# Altium project GargantuRAM_1_5_PRE_GITHUB.PrjPcb (part 2 of 3)

## Sheet SD_RTC_SPI.SchDoc
size A0; SheetNumber: 6; SheetTotal: 12
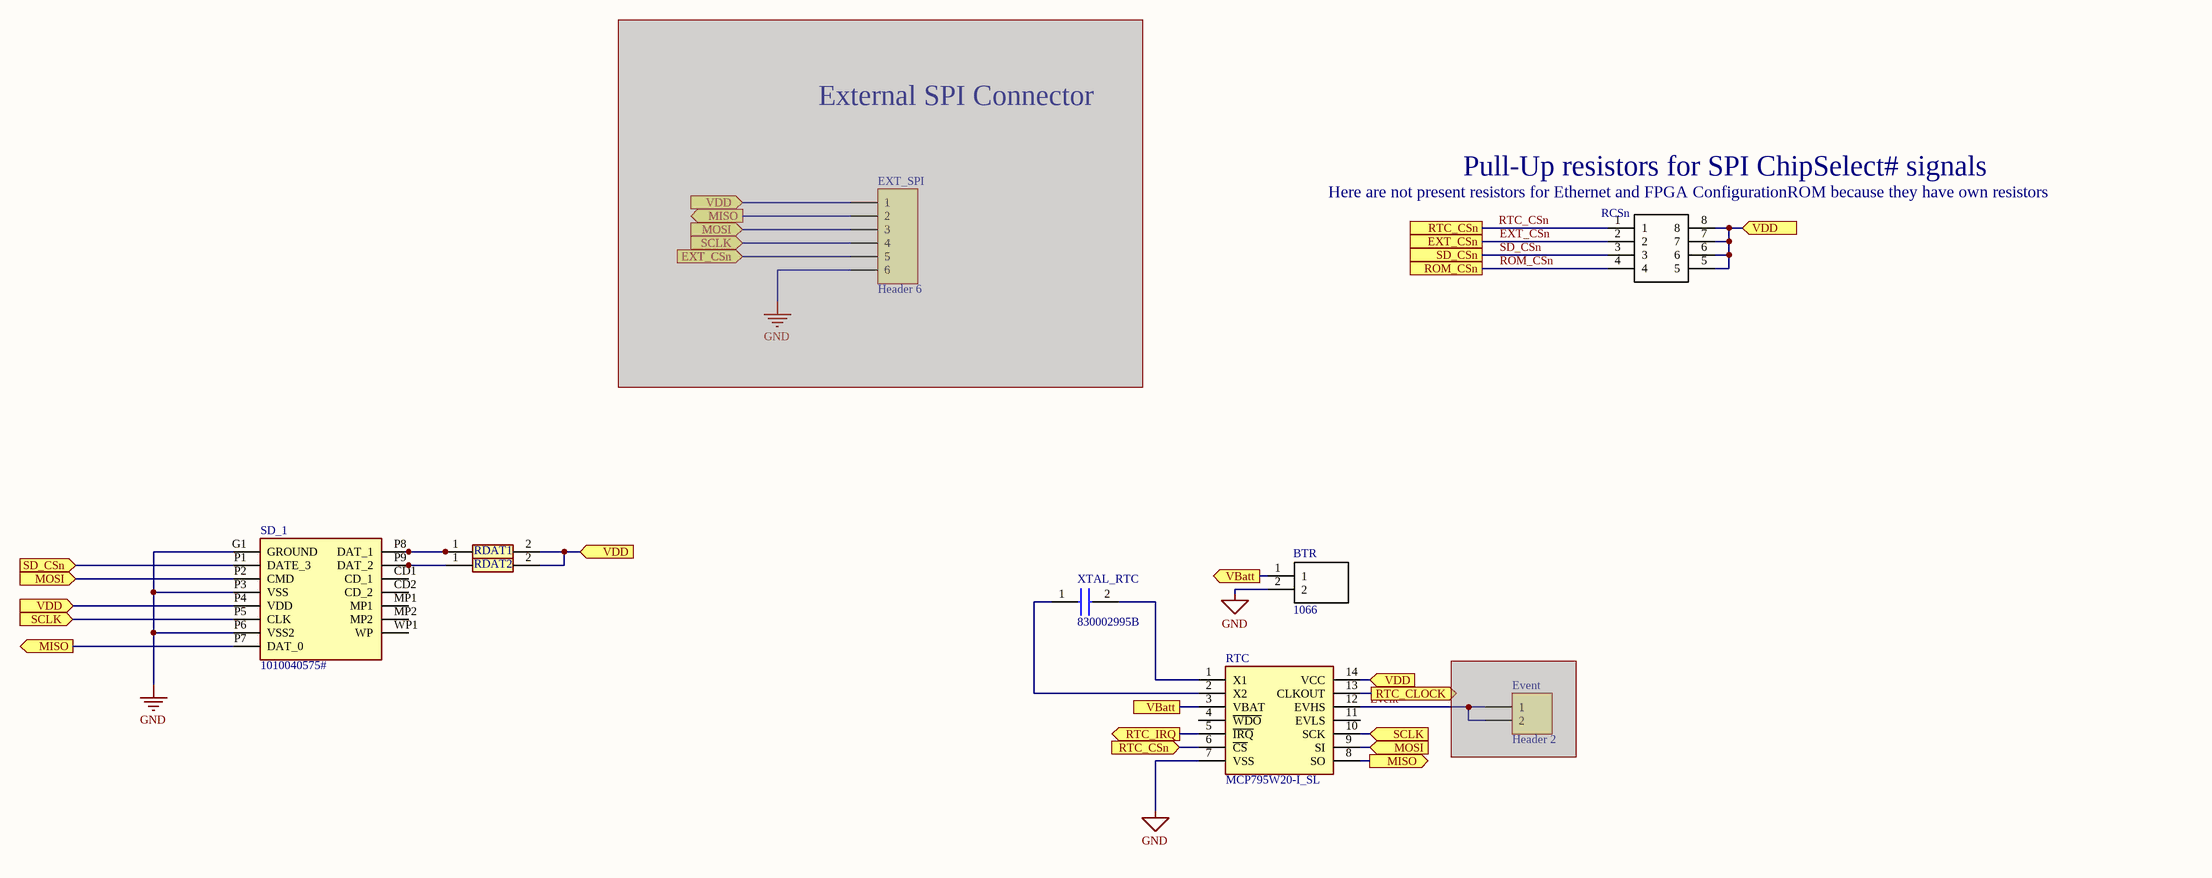
[diagram p7: SD_RTC_SPI.SchDoc]

### Parts
BTR  1066  [1066]
Event  Header 2  [HDR1X2]  (masked out: inside a compile mask, not in the netlist)
EXT_SPI  Header 6  [HDR1X6]  (masked out: inside a compile mask, not in the netlist)
RCSn  CAT16A-1002F4LF  [CAT16A1002F4LF]  (value not drawn)
RDAT1  CRCW060310K0FKEC  [RESC1608X50N]  (value not drawn)
RDAT2  CRCW060310K0FKEC  [RESC1608X50N]  (value not drawn)
RTC  MCP795W20-I_SL  [SOIC127P600X175-14N]
SD_1  1010040575#  [1010040575]
XTAL_RTC  830002995B  [830002995B]

### Ports
EXT_CSn, EXT_CSn (in), MISO (out), MOSI (in), ROM_CSn, RTC_CLOCK (out), RTC_CSn, RTC_CSn (in), RTC_IRQ (out), SCLK (in), SD_CSn, SD_CSn (in), VBatt, VBatt (out), VDD (in)

### Nets
GND: BTR.2 RTC.7(VSS) SD_1.G1(GROUND) SD_1.P3(VSS) SD_1.P6(VSS2)
Event: RTC.12(EVHS)
EXT_CSn: RCSn.2 ; port EXT_CSn
MISO: RTC.8(SO) SD_1.P7(DAT_0) ; port MISO
MOSI: RTC.9(SI) SD_1.P2(CMD) ; port MOSI
ROM_CSn: RCSn.4 ; port ROM_CSn
RTC_CLOCK: RTC.13(CLKOUT) ; port RTC_CLOCK
RTC_CSn: RCSn.1 RTC.6(~{CS}) ; port RTC_CSn
RTC_IRQ: RTC.5(~{IRQ}) ; port RTC_IRQ
SCLK: RTC.10(SCK) SD_1.P5(CLK) ; port SCLK
SD_CSn: RCSn.3 SD_1.P1(DATE_3) ; port SD_CSn
VDD: RCSn.5 RCSn.6 RCSn.7 RCSn.8 RDAT1.2 RDAT2.2 RTC.14(VCC) SD_1.P4(VDD) ; port VDD
NetBTR_1: BTR.1 RTC.3(VBAT) ; port VBatt
NetRDAT1_1: RDAT1.1 SD_1.P8(DAT_1)
NetRDAT2_1: RDAT2.1 SD_1.P9(DAT_2)
NetRTC_1: RTC.1(X1) XTAL_RTC.2(CRYSTAL_2)
NetRTC_2: RTC.2(X2) XTAL_RTC.1(CRYSTAL_1)

Not connected (* = marked no-connect by the designer): RTC 4(~{WDO}) 11(EVLS); SD_1 CD1(CD_1) CD2(CD_2) MP1 MP2 WP1(WP)

### Notes on the sheet
- External SPI Connector
- (near RCSn) Pull-Up resistors for SPI ChipSelect# signals
- (near RCSn) Here are not present resistors for Ethernet and FPGA ConfigurationROM because they have own resistors

### Library data of the parts
BTR = 1066: Undefined or Miscellaneous; Manufacturer_Name: Keystone Electronics; Datasheet Link: http://keyelco.com/userAssets/file/M65p5.pdf; Height: 9.85mm; Manufacturer_Part_Number: 1066; Mouser Part Number: 534-1066; Mouser Price/Stock: https://www.mouser.co.uk/ProductDetail/Keystone-Electronics/1066?qs=TMDrOSIpnUfyx7dWA5t7YA%3D%3D
Event = Header 2: Header, 2-Pin; LatestRevisionDate: 17-Jul-2002; LatestRevisionNote: Re-released for DXP Platform.; Publisher: Altium Limited
EXT_SPI = Header 6: Header, 6-Pin; LatestRevisionDate: 17-Jul-2002; LatestRevisionNote: Re-released for DXP Platform.; Publisher: Altium Limited
RCSn = CAT16A-1002F4LF: Resistor Network; Manufacturer_Name: Bourns; Datasheet Link: https://www.bourns.com/docs/product-datasheets/cat16a-lf.pdf?sfvrsn=f78c48f6_4; Height: 0.65mm; Manufacturer_Part_Number: CAT16A-1002F4LF; Mouser Part Number: 652-CAT16A-1002F4LF; Mouser Price/Stock: https://www.mouser.co.uk/ProductDetail/Bourns/CAT16A-1002F4LF?qs=IS%252B4QmGtzzqwI8c1abvAYA%3D%3D
RDAT1 RDAT2 = CRCW060310K0FKEC: Resistor; Manufacturer_Name: Vishay; Datasheet Link: http://www.vishay.com/docs/20035/dcrcwe3.pdf; Height: 0.5mm; Manufacturer_Part_Number: CRCW060310K0FKEC; Mouser Part Number: 71-CRCW060310K0FKEC; Mouser Price/Stock: https://www.mouser.co.uk/ProductDetail/Vishay-Dale/CRCW060310K0FKEC?qs=DhCTQV%252BB7kVUX5brQUG3LA%3D%3D; Arrow Part Number: CRCW060310K0FKEC; Arrow Price/Stock: https://www.arrow.com/en/products/crcw060310k0fkec/vishay?region=nac
RTC = MCP795W20-I_SL: Integrated Circuit; Manufacturer_Name: Microchip; Manufacturer_Part_Number: MCP795W20-I/SL; Datasheet Link: http://www.microchip.com/mymicrochip/filehandler.aspx?ddocname=en556469; Height: 1.75mm; Mouser Part Number: 579-MCP795W20-I/SL; Mouser Price/Stock: https://www.mouser.co.uk/ProductDetail/Microchip-Technology/MCP795W20-I-SL?qs=tc5aKIj3JEqUBv0X09nRdg%3D%3D; Arrow Part Number: MCP795W20-I/SL; Arrow Price/Stock: https://www.arrow.com/en/products/mcp795w20-isl/microchip-technology
SD_1 = 1010040575#: Connector; Manufacturer_Name: Amphenol Communications Solutions; Datasheet Link: https://cdn.amphenol-cs.com/media/wysiwyg/files/drawing/1010040575.pdf; Height: 4.8mm; Manufacturer_Part_Number: 1010040575#; Mouser Part Number: 523-1010040575#; Mouser Price/Stock: https://www.mouser.co.uk/ProductDetail/Amphenol-Commercial-Products/1010040575?qs=ToP8pWlZ0bNfojQLHmjlUA%3D%3D; Arrow Part Number: 1010040575#; Arrow Price/Stock: https://www.arrow.com/en/products/1010040575/amphenol
XTAL_RTC = 830002995B: Capacitor; Manufacturer_Name: Wurth Elektronik; Datasheet Link: https://www.mouser.de/datasheet/2/445/830002995B-2005217.pdf; Height: 8.2mm; Manufacturer_Part_Number: 830002995B; Mouser Part Number: 710-830002995B; Mouser Price/Stock: https://www.mouser.co.uk/ProductDetail/Wurth-Elektronik/830002995B?qs=2WXlatMagcHCnw26vHVZcg%3D%3D

## Sheet RAM.SchDoc
size A0; SheetNumber: 7; SheetTotal: 12
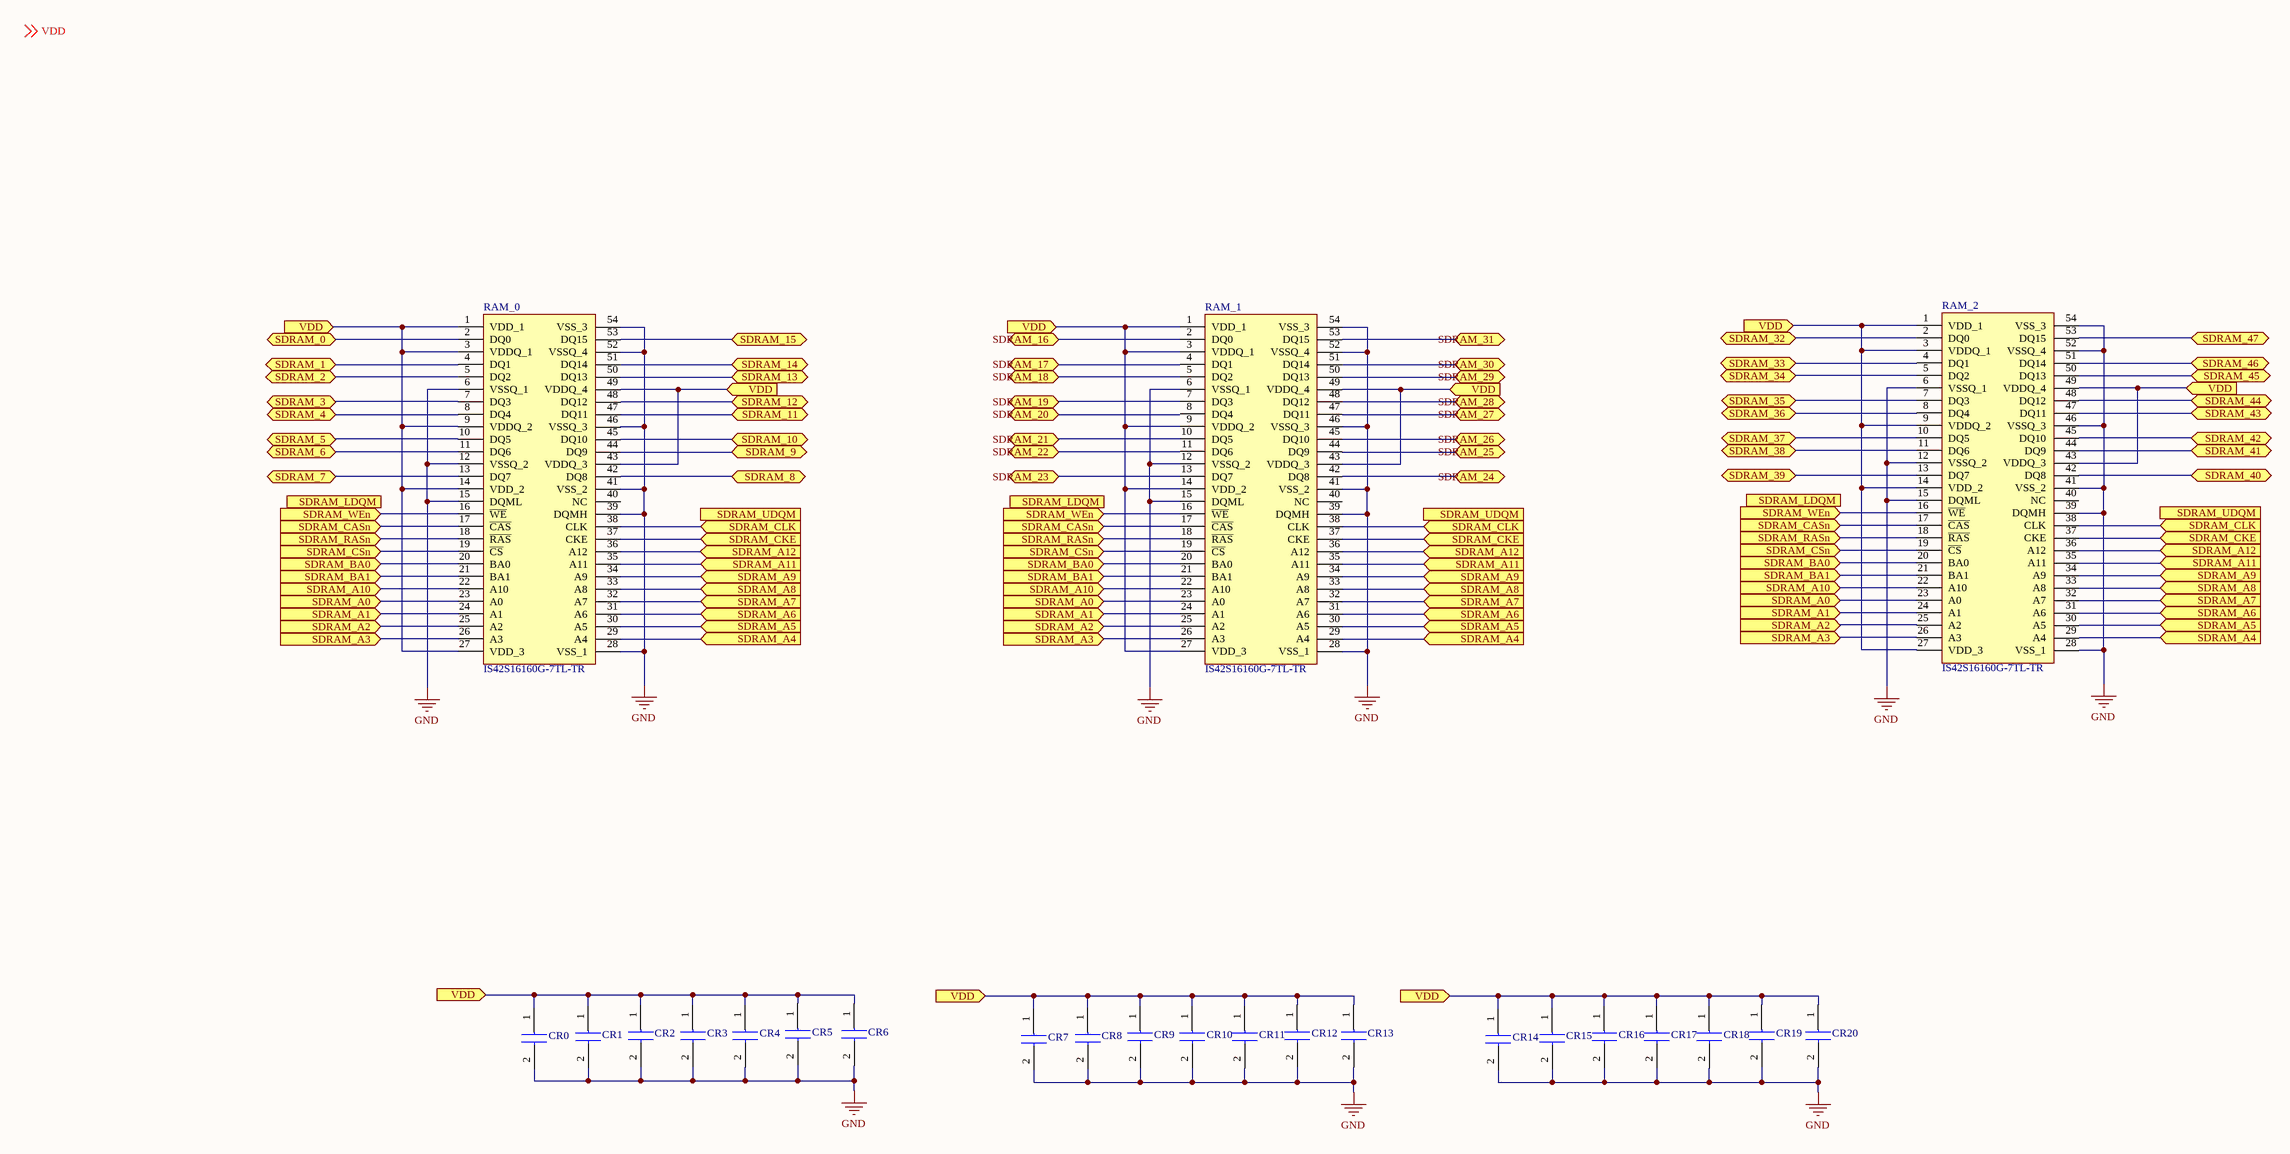
[diagram p8: RAM.SchDoc]

### Parts
CR0  GRM155R71C104JA88D  [CAPC1005X55N]  (value not drawn)
CR1  GRM155R71C104JA88D  [CAPC1005X55N]  (value not drawn)
CR2  GRM155R71C104JA88D  [CAPC1005X55N]  (value not drawn)
CR3  GRM155R71C104JA88D  [CAPC1005X55N]  (value not drawn)
CR4  GRM155R71C104JA88D  [CAPC1005X55N]  (value not drawn)
CR5  GRM155R71C104JA88D  [CAPC1005X55N]  (value not drawn)
CR6  GRM155R71C104JA88D  [CAPC1005X55N]  (value not drawn)
CR7  GRM155R71C104JA88D  [CAPC1005X55N]  (value not drawn)
CR8  GRM155R71C104JA88D  [CAPC1005X55N]  (value not drawn)
CR9  GRM155R71C104JA88D  [CAPC1005X55N]  (value not drawn)
CR10  GRM155R71C104JA88D  [CAPC1005X55N]  (value not drawn)
CR11  GRM155R71C104JA88D  [CAPC1005X55N]  (value not drawn)
CR12  GRM155R71C104JA88D  [CAPC1005X55N]  (value not drawn)
CR13  GRM155R71C104JA88D  [CAPC1005X55N]  (value not drawn)
CR14  GRM155R71C104JA88D  [CAPC1005X55N]  (value not drawn)
CR15  GRM155R71C104JA88D  [CAPC1005X55N]  (value not drawn)
CR16  GRM155R71C104JA88D  [CAPC1005X55N]  (value not drawn)
CR17  GRM155R71C104JA88D  [CAPC1005X55N]  (value not drawn)
CR18  GRM155R71C104JA88D  [CAPC1005X55N]  (value not drawn)
CR19  GRM155R71C104JA88D  [CAPC1005X55N]  (value not drawn)
CR20  GRM155R71C104JA88D  [CAPC1005X55N]  (value not drawn)
RAM_0  IS42S16160G-7TL-TR  [SOP80P1176X120-54N]
RAM_1  IS42S16160G-7TL-TR  [SOP80P1176X120-54N]
RAM_2  IS42S16160G-7TL-TR  [SOP80P1176X120-54N]

### Ports
SDRAM_0 (bidir), SDRAM_1 (bidir), SDRAM_2 (bidir), SDRAM_3 (bidir), SDRAM_4 (bidir), SDRAM_5 (bidir), SDRAM_6 (bidir), SDRAM_7 (bidir), SDRAM_8 (bidir), SDRAM_9 (bidir), SDRAM_10 (bidir), SDRAM_11 (bidir), SDRAM_12 (bidir), SDRAM_13 (bidir), SDRAM_14 (bidir), SDRAM_15 (bidir), SDRAM_16 (bidir), SDRAM_17 (bidir), SDRAM_18 (bidir), SDRAM_19 (bidir), SDRAM_20 (bidir), SDRAM_21 (bidir), SDRAM_22 (bidir), SDRAM_23 (bidir), SDRAM_24 (bidir), SDRAM_25 (bidir), SDRAM_26 (bidir), SDRAM_27 (bidir), SDRAM_28 (bidir), SDRAM_29 (bidir), SDRAM_30 (bidir), SDRAM_31 (bidir), SDRAM_32 (bidir), SDRAM_33 (bidir), SDRAM_34 (bidir), SDRAM_35 (bidir), SDRAM_36 (bidir), SDRAM_37 (bidir), SDRAM_38 (bidir), SDRAM_39 (bidir), SDRAM_40 (bidir), SDRAM_41 (bidir), SDRAM_42 (bidir), SDRAM_43 (bidir), SDRAM_44 (bidir), SDRAM_45 (bidir), SDRAM_46 (bidir), SDRAM_47 (bidir), SDRAM_A0 (in), SDRAM_A1 (in), SDRAM_A2 (in), SDRAM_A3 (in), SDRAM_A4 (in), SDRAM_A5 (in), SDRAM_A6 (in), SDRAM_A7 (in), SDRAM_A8 (in), SDRAM_A9 (in), SDRAM_A10 (in), SDRAM_A11 (in), SDRAM_A12 (in), SDRAM_BA0 (in), SDRAM_BA1 (in), SDRAM_CASn (in), SDRAM_CKE (in), SDRAM_CLK (in), SDRAM_CSn (in), SDRAM_LDQM (in), SDRAM_RASn (in), SDRAM_UDQM (in), SDRAM_WEn (in), VDD (in)

### Nets
GND: CR0.2 CR1.2 CR2.2 CR3.2 CR4.2 CR5.2 CR6.2 CR7.2 CR8.2 CR9.2 CR10.2 CR11.2 CR12.2 CR13.2 CR14.2 CR15.2 CR16.2 CR17.2 CR18.2 CR19.2 CR20.2 RAM_0.6(VSSQ_1) RAM_0.12(VSSQ_2) RAM_0.15(DQML) RAM_0.28(VSS_1) RAM_0.39(DQMH) RAM_0.41(VSS_2) RAM_0.46(VSSQ_3) RAM_0.52(VSSQ_4) RAM_0.54(VSS_3) RAM_1.6(VSSQ_1) RAM_1.12(VSSQ_2) RAM_1.15(DQML) RAM_1.28(VSS_1) RAM_1.39(DQMH) RAM_1.41(VSS_2) RAM_1.46(VSSQ_3) RAM_1.52(VSSQ_4) RAM_1.54(VSS_3) RAM_2.6(VSSQ_1) RAM_2.12(VSSQ_2) RAM_2.15(DQML) RAM_2.28(VSS_1) RAM_2.39(DQMH) RAM_2.41(VSS_2) RAM_2.46(VSSQ_3) RAM_2.52(VSSQ_4) RAM_2.54(VSS_3)
BA0: RAM_0.20(BA0) RAM_1.20(BA0) RAM_2.20(BA0) ; port SDRAM_BA0
BA1: RAM_0.21(BA1) RAM_1.21(BA1) RAM_2.21(BA1) ; port SDRAM_BA1
CASn: RAM_0.17(~{CAS}) RAM_1.17(~{CAS}) RAM_2.17(~{CAS}) ; port SDRAM_CASn
CKE: RAM_0.37(CKE) RAM_1.37(CKE) RAM_2.37(CKE) ; port SDRAM_CKE
CSn: RAM_0.19(~{CS}) RAM_1.19(~{CS}) RAM_2.19(~{CS}) ; port SDRAM_CSn
RAM_CLK: RAM_0.38(CLK) RAM_1.38(CLK) RAM_2.38(CLK) ; port SDRAM_CLK
RASn: RAM_0.18(~{RAS}) RAM_1.18(~{RAS}) RAM_2.18(~{RAS}) ; port SDRAM_RASn
SDRAM_A1: RAM_0.24(A1) RAM_1.24(A1) RAM_2.24(A1) ; port SDRAM_A1
SDRAM_A2: RAM_0.25(A2) RAM_1.25(A2) RAM_2.25(A2) ; port SDRAM_A2
VDD: CR0.1 CR1.1 CR2.1 CR3.1 CR4.1 CR5.1 CR6.1 CR7.1 CR8.1 CR9.1 CR10.1 CR11.1 CR12.1 CR13.1 CR14.1 CR15.1 CR16.1 CR17.1 CR18.1 CR19.1 CR20.1 RAM_0.1(VDD_1) RAM_0.3(VDDQ_1) RAM_0.9(VDDQ_2) RAM_0.14(VDD_2) RAM_0.27(VDD_3) RAM_0.43(VDDQ_3) RAM_0.49(VDDQ_4) RAM_1.1(VDD_1) RAM_1.3(VDDQ_1) RAM_1.9(VDDQ_2) RAM_1.14(VDD_2) RAM_1.27(VDD_3) RAM_1.43(VDDQ_3) RAM_1.49(VDDQ_4) RAM_2.1(VDD_1) RAM_2.3(VDDQ_1) RAM_2.9(VDDQ_2) RAM_2.14(VDD_2) RAM_2.27(VDD_3) RAM_2.43(VDDQ_3) RAM_2.49(VDDQ_4) ; port VDD
WEn: RAM_0.16(~{WE}) RAM_1.16(~{WE}) RAM_2.16(~{WE}) ; port SDRAM_WEn
NetLassye3_AA13: RAM_0.23(A0) RAM_1.23(A0) RAM_2.23(A0) ; port SDRAM_A0
NetLassye3_AB2: RAM_0.26(A3) RAM_1.26(A3) RAM_2.26(A3) ; port SDRAM_A3
NetLassye3_AB3: RAM_0.29(A4) RAM_1.29(A4) RAM_2.29(A4) ; port SDRAM_A4
NetLassye3_AB4: RAM_0.30(A5) RAM_1.30(A5) RAM_2.30(A5) ; port SDRAM_A5
NetLassye3_AB5: RAM_0.31(A6) RAM_1.31(A6) RAM_2.31(A6) ; port SDRAM_A6
NetLassye3_AB6: RAM_0.32(A7) RAM_1.32(A7) RAM_2.32(A7) ; port SDRAM_A7
NetLassye3_AB7: RAM_0.33(A8) RAM_1.33(A8) RAM_2.33(A8) ; port SDRAM_A8
NetLassye3_AB8: RAM_0.34(A9) RAM_1.34(A9) RAM_2.34(A9) ; port SDRAM_A9
NetLassye3_AB9: RAM_0.22(A10) RAM_1.22(A10) RAM_2.22(A10) ; port SDRAM_A10
NetLassye3_AB10: RAM_0.35(A11) RAM_1.35(A11) RAM_2.35(A11) ; port SDRAM_A11
NetLassye3_AB11: RAM_0.2(DQ0) ; port SDRAM_0
NetLassye3_AB12: RAM_0.4(DQ1) ; port SDRAM_1
NetLassye3_AB13: RAM_0.5(DQ2) ; port SDRAM_2
NetLassye3_AB14: RAM_0.7(DQ3) ; port SDRAM_3
NetLassye3_AB17: RAM_0.11(DQ6) ; port SDRAM_6
NetLassye3_P1: RAM_1.10(DQ5) ; port SDRAM_21
NetLassye3_P2: RAM_1.11(DQ6) ; port SDRAM_22
NetLassye3_P3: RAM_1.13(DQ7) ; port SDRAM_23
NetLassye3_P4: RAM_1.53(DQ15) ; port SDRAM_31
NetLassye3_R1: RAM_2.47(DQ11) ; port SDRAM_43
NetLassye3_R2: RAM_2.48(DQ12) ; port SDRAM_44
NetLassye3_R3: RAM_2.50(DQ13) ; port SDRAM_45
NetLassye3_R6: RAM_2.51(DQ14) ; port SDRAM_46
NetLassye3_R7: RAM_2.53(DQ15) ; port SDRAM_47
NetLassye3_R10: RAM_0.36(A12) RAM_1.36(A12) RAM_2.36(A12) ; port SDRAM_A12
NetLassye3_T6: RAM_2.42(DQ8) ; port SDRAM_40
NetLassye3_T8: RAM_2.44(DQ9) ; port SDRAM_41
NetLassye3_T10: RAM_2.45(DQ10) ; port SDRAM_42
NetLassye3_T13: RAM_0.8(DQ4) ; port SDRAM_4
NetLassye3_T14: RAM_0.10(DQ5) ; port SDRAM_5
NetLassye3_U7: RAM_2.2(DQ0) ; port SDRAM_32
NetLassye3_U8: RAM_2.4(DQ1) ; port SDRAM_33
NetLassye3_U9: RAM_2.5(DQ2) ; port SDRAM_34
NetLassye3_U10: RAM_2.7(DQ3) ; port SDRAM_35
NetLassye3_U11: RAM_2.8(DQ4) ; port SDRAM_36
NetLassye3_U12: RAM_2.10(DQ5) ; port SDRAM_37
NetLassye3_U13: RAM_2.11(DQ6) ; port SDRAM_38
NetLassye3_U14: RAM_2.13(DQ7) ; port SDRAM_39
NetLassye3_V7: RAM_1.42(DQ8) ; port SDRAM_24
NetLassye3_V8: RAM_1.44(DQ9) ; port SDRAM_25
NetLassye3_V9: RAM_1.45(DQ10) ; port SDRAM_26
NetLassye3_V10: RAM_1.47(DQ11) ; port SDRAM_27
NetLassye3_V11: RAM_1.48(DQ12) ; port SDRAM_28
NetLassye3_V12: RAM_1.50(DQ13) ; port SDRAM_29
NetLassye3_V14: RAM_1.51(DQ14) ; port SDRAM_30
NetLassye3_W2: RAM_0.48(DQ12) ; port SDRAM_12
NetLassye3_W3: RAM_0.50(DQ13) ; port SDRAM_13
NetLassye3_W4: RAM_0.51(DQ14) ; port SDRAM_14
NetLassye3_W8: RAM_0.53(DQ15) ; port SDRAM_15
NetLassye3_W9: RAM_1.2(DQ0) ; port SDRAM_16
NetLassye3_W10: RAM_1.4(DQ1) ; port SDRAM_17
NetLassye3_W11: RAM_1.5(DQ2) ; port SDRAM_18
NetLassye3_W12: RAM_1.7(DQ3) ; port SDRAM_19
NetLassye3_W14: RAM_1.8(DQ4) ; port SDRAM_20
NetLassye3_Y1: RAM_0.13(DQ7) ; port SDRAM_7
NetLassye3_Y6: RAM_0.42(DQ8) ; port SDRAM_8
NetLassye3_Y7: RAM_0.44(DQ9) ; port SDRAM_9
NetLassye3_Y13: RAM_0.45(DQ10) ; port SDRAM_10
NetLassye3_Y14: RAM_0.47(DQ11) ; port SDRAM_11

Not connected (* = marked no-connect by the designer): RAM_0 40(NC); RAM_1 40(NC); RAM_2 40(NC)

### Notes on the sheet
- Labels drawn without touching a wire or pin: VDD

### Library data of the parts
CR0-CR20 = GRM155R71C104JA88D: Capacitor; Manufacturer_Name: Murata Electronics; Datasheet Link: http://www.murata.com/~/media/webrenewal/support/library/catalog/products/capacitor/mlcc/c02e.pdf; Height: 0.55mm; Manufacturer_Part_Number: GRM155R71C104JA88D; Mouser Part Number: 81-GRM155R71C104JA8D; Mouser Price/Stock: https://www.mouser.co.uk/ProductDetail/Murata-Electronics/GRM155R71C104JA88D?qs=pwh76yelNxDjPOceoz6xEg%3D%3D; Arrow Part Number: GRM155R71C104JA88D; Arrow Price/Stock: https://www.arrow.com/en/products/grm155r71c104ja88d/murata-manufacturing?region=nac
RAM_0-RAM_2 = IS42S16160G-7TL-TR: Integrated Circuit; Manufacturer_Name: Integrated Silicon Solution Inc.; Datasheet Link: http://www.issi.com/WW/pdf/42-45S83200G-16160G.pdf; Height: 1.2mm; Manufacturer_Part_Number: IS42S16160G-7TL-TR; Mouser Part Number: 870-IS42S16160G7TLTR; Mouser Price/Stock: https://www.mouser.co.uk/ProductDetail/ISSI/IS42S16160G-7TL-TR?qs=9hm%252BDT1Jr7xnYjoaQib7SQ%3D%3D; Arrow Part Number: IS42S16160G-7TL-TR; Arrow Price/Stock: https://www.arrow.com/en/products/is42s16160g-7tl-tr/integrated-silicon-solution-inc?region=nac

## Sheet FPGA.SchDoc
size A0; SheetNumber: 8; SheetTotal: 12
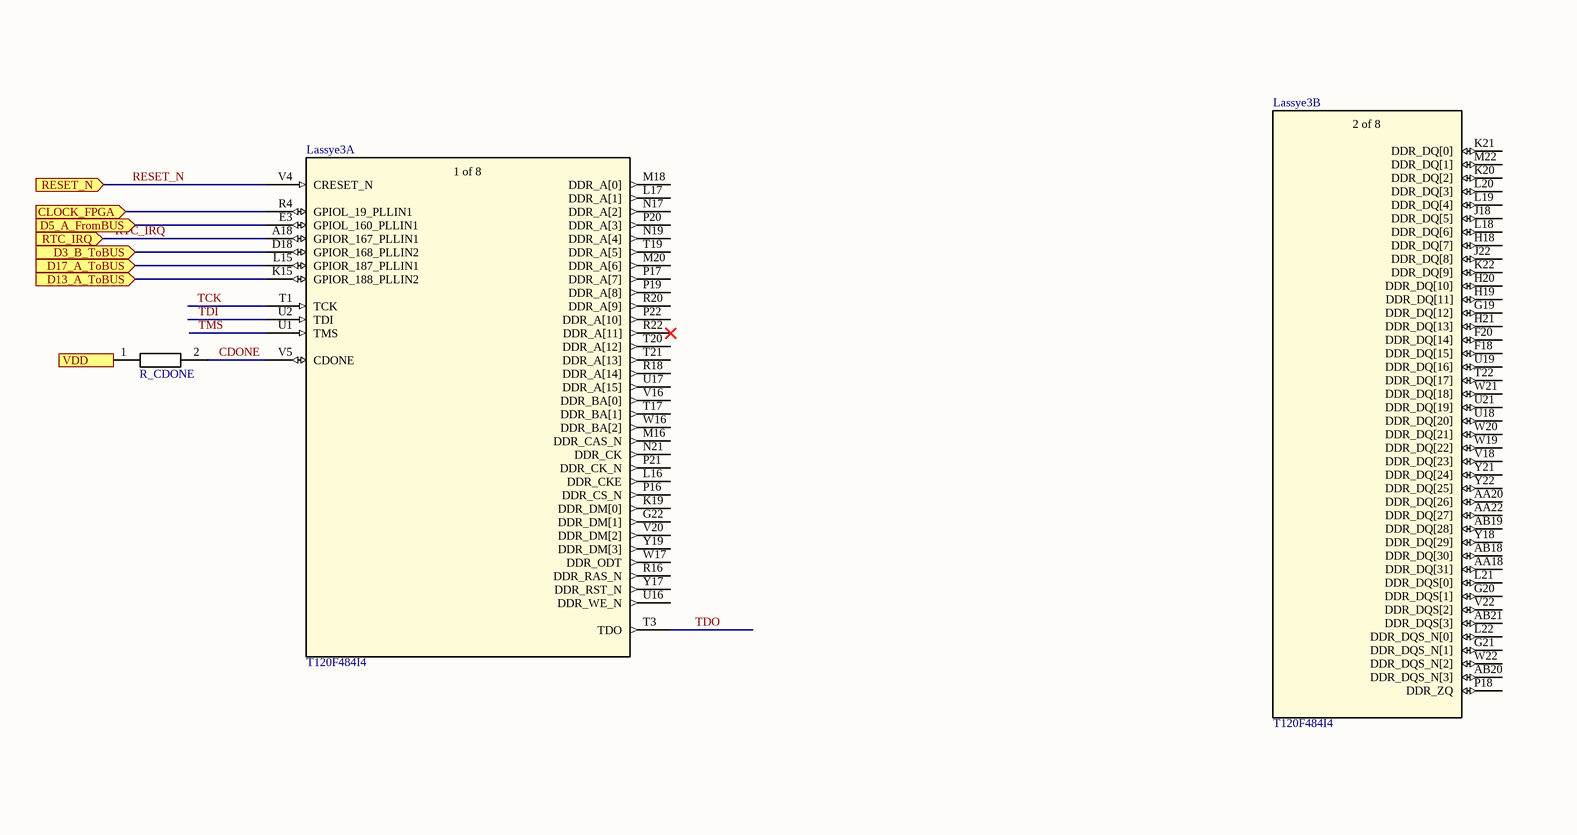
[diagram p9: FPGA.SchDoc, top left]
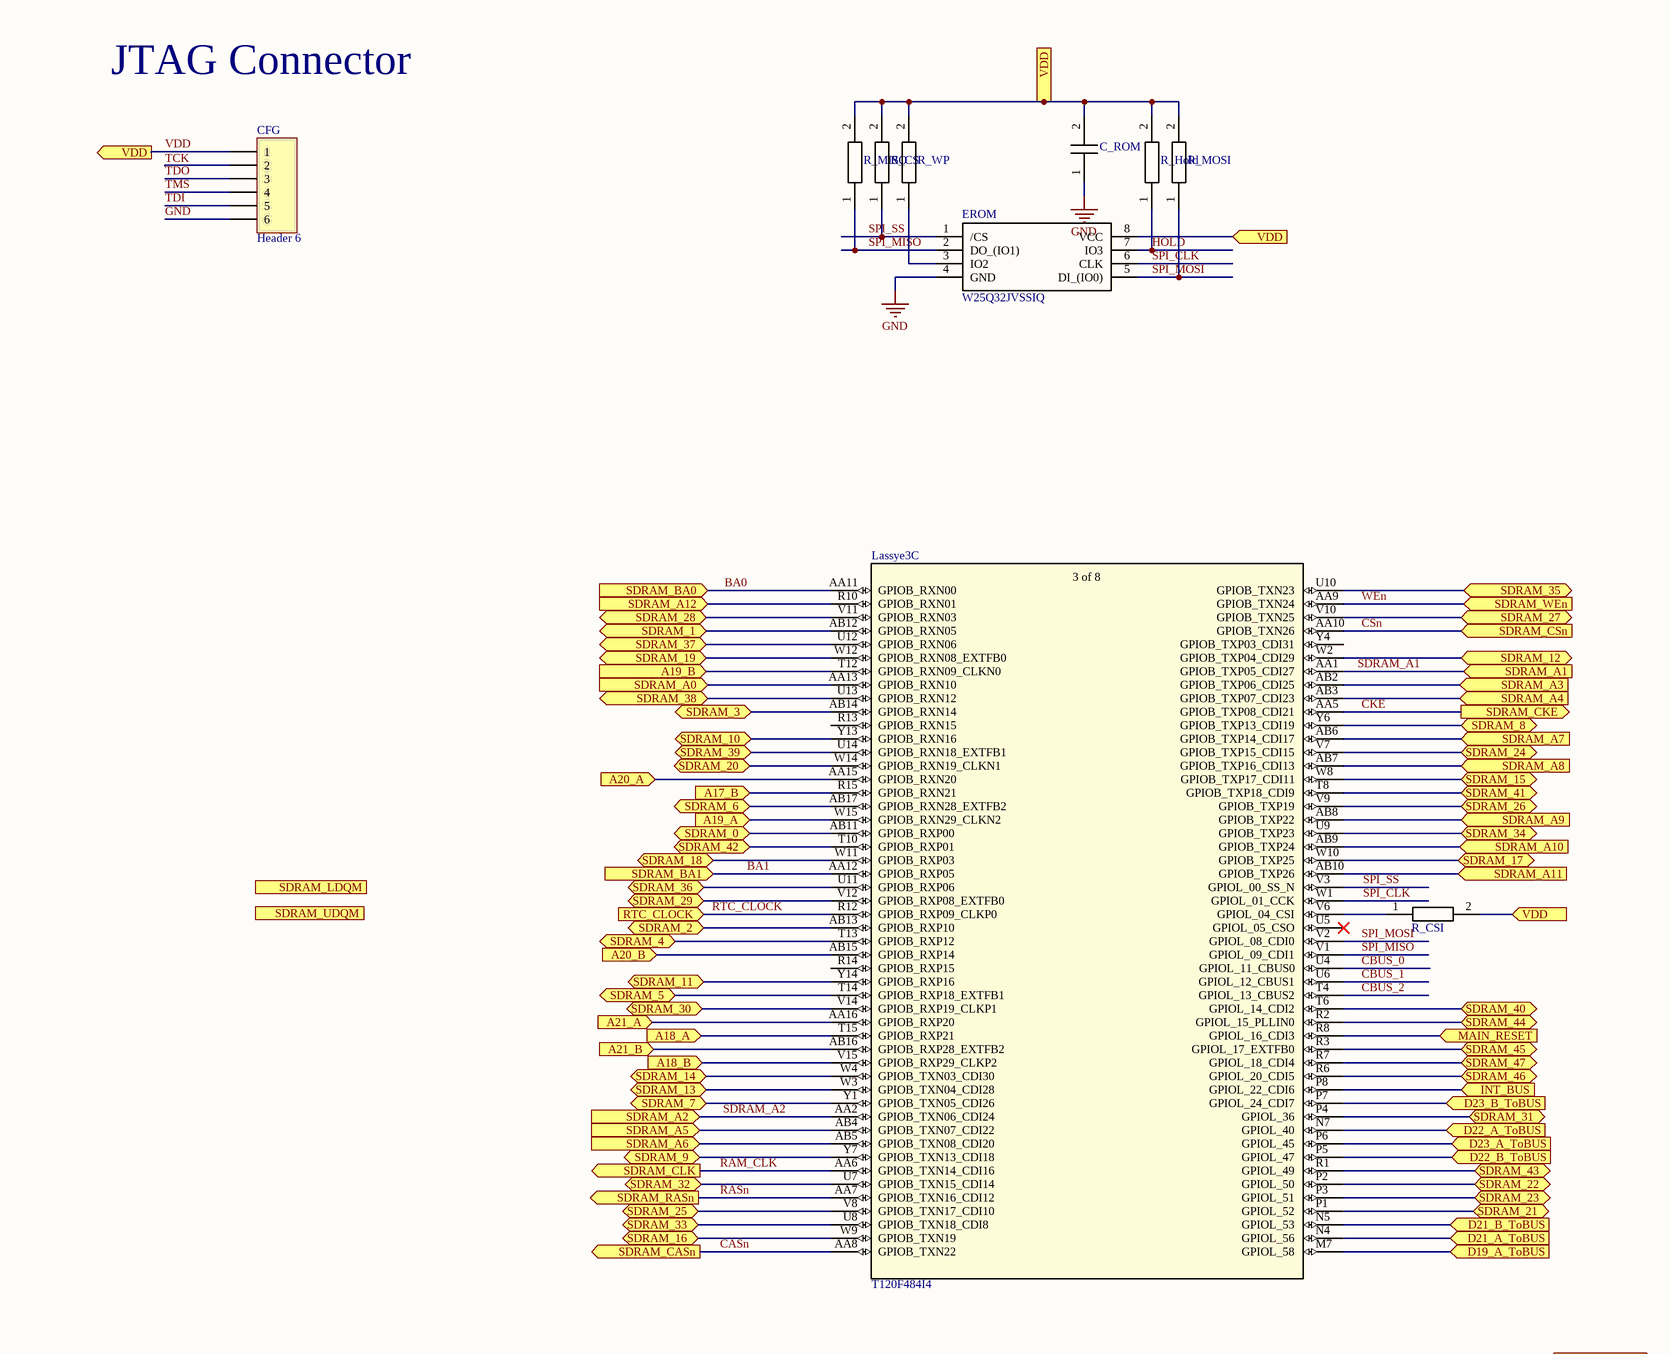
[diagram p10: FPGA.SchDoc, top middle]
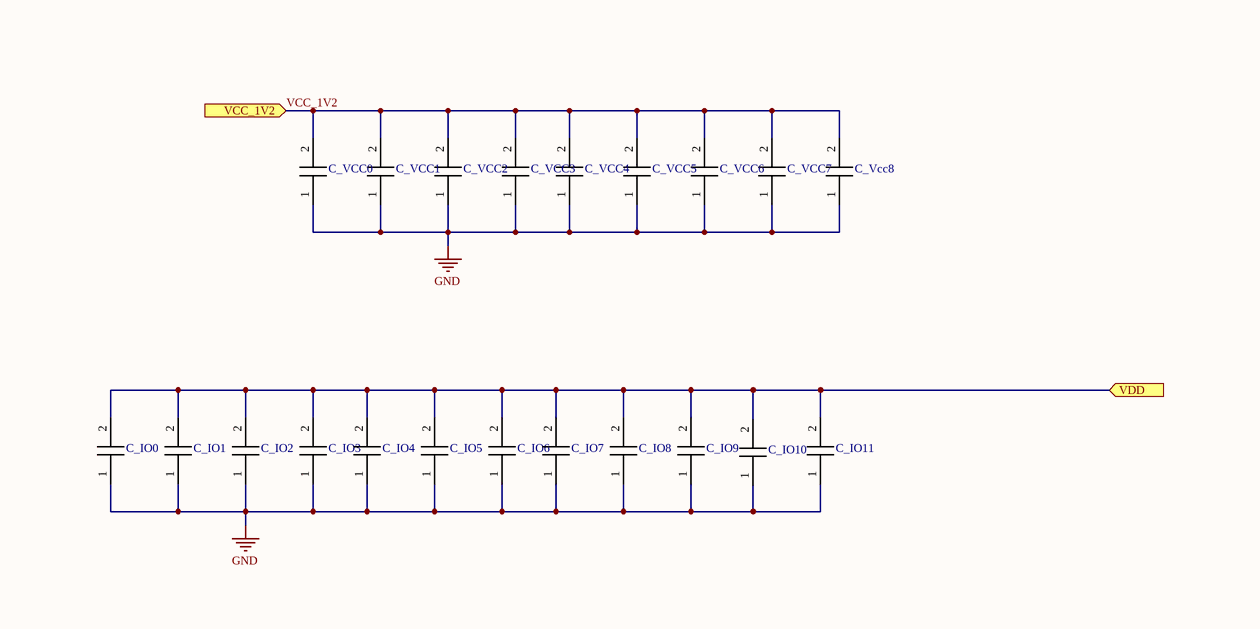
[diagram p11: FPGA.SchDoc, top right]
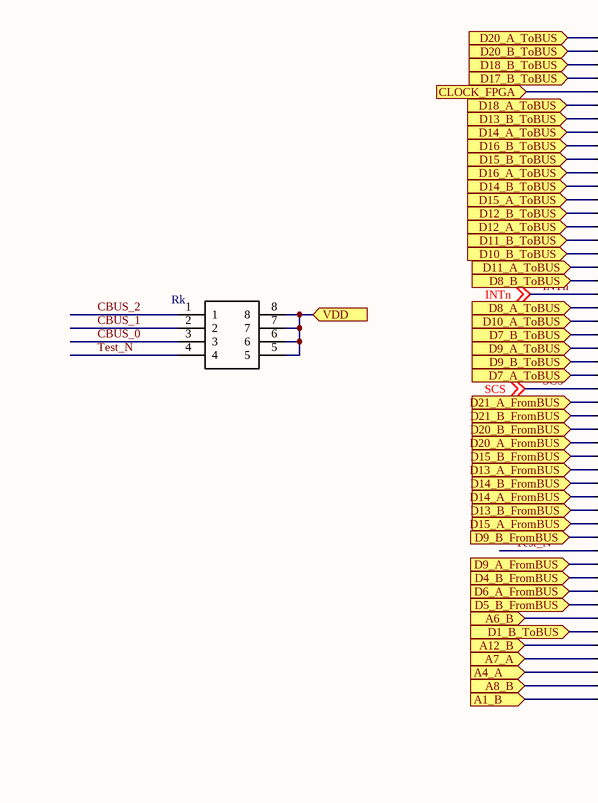
[diagram p12: FPGA.SchDoc, bottom middle]
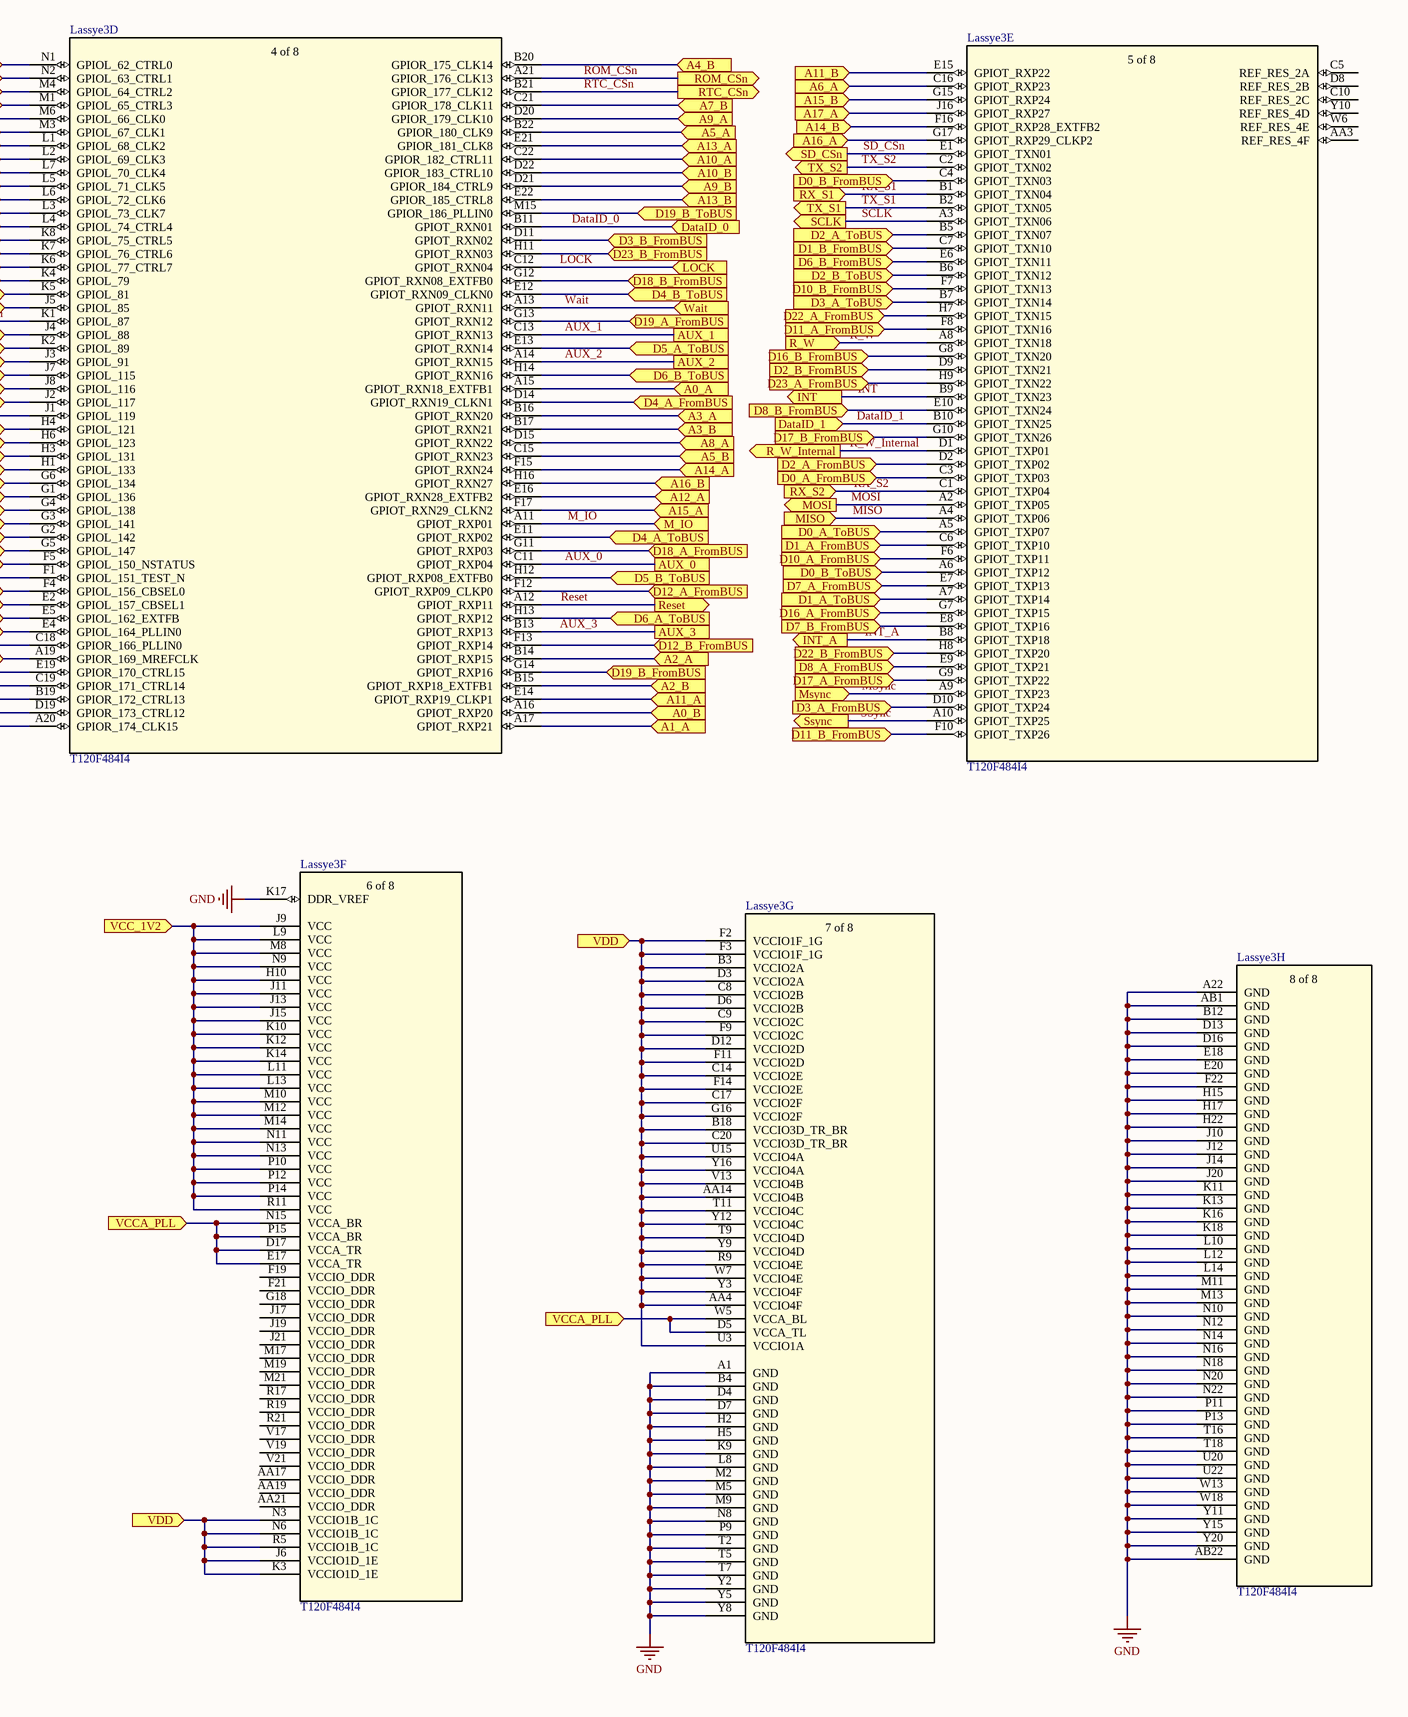
[diagram p13: FPGA.SchDoc, bottom right]

### Parts
C_IO0  GRM155R71C104JA88J  [CAPC1005X55N]  (value not drawn)
C_IO1  GRM155R71C104JA88J  [CAPC1005X55N]  (value not drawn)
C_IO2  GRM155R71C104JA88J  [CAPC1005X55N]  (value not drawn)
C_IO3  GRM155R71C104JA88J  [CAPC1005X55N]  (value not drawn)
C_IO4  GRM155R71C104JA88J  [CAPC1005X55N]  (value not drawn)
C_IO5  GRM155R71C104JA88J  [CAPC1005X55N]  (value not drawn)
C_IO6  GRM155R71C104JA88J  [CAPC1005X55N]  (value not drawn)
C_IO7  GRM155R71C104JA88J  [CAPC1005X55N]  (value not drawn)
C_IO8  GRM155R71C104JA88J  [CAPC1005X55N]  (value not drawn)
C_IO9  GRM155R71C104JA88J  [CAPC1005X55N]  (value not drawn)
C_IO10  GRM155R71C104JA88J  [CAPC1005X55N]  (value not drawn)
C_IO11  GRM155R71C104JA88J  [CAPC1005X55N]  (value not drawn)
C_ROM  0603YC104K4T2A  [CAPC1608X90N]  (value not drawn)
C_VCC0  GRM155R71C104JA88J  [CAPC1005X55N]  (value not drawn)
C_VCC1  GRM155R71C104JA88J  [CAPC1005X55N]  (value not drawn)
C_VCC2  GRM155R71C104JA88J  [CAPC1005X55N]  (value not drawn)
C_VCC3  GRM155R71C104JA88J  [CAPC1005X55N]  (value not drawn)
C_VCC4  GRM155R71C104JA88J  [CAPC1005X55N]  (value not drawn)
C_VCC5  GRM155R71C104JA88J  [CAPC1005X55N]  (value not drawn)
C_VCC6  GRM155R71C104JA88J  [CAPC1005X55N]  (value not drawn)
C_VCC7  GRM155R71C104JA88J  [CAPC1005X55N]  (value not drawn)
C_Vcc8  GRM155R71C104JA88J  [CAPC1005X55N]  (value not drawn)
CFG  Header 6  [HDR1X6]
EROM  W25Q32JVSSIQ  [SOIC127P790X216-8N]
Lassye3  T120F484I4  [FBGA484_TRION_EFI]  (parts A,B,C,D,E,F,G,H of 8)
R_CDONE  CRCW060310K0FKEB  [RESC1608X50N]  (value not drawn)
R_CS  CRCW060310K0FKEB  [RESC1608X50N]  (value not drawn)
R_CSI  CRCW060310K0FKEB  [RESC1608X50N]  (value not drawn)
R_Hold  CRCW060310K0FKEB  [RESC1608X50N]  (value not drawn)
R_MISO  CRCW060310K0FKEB  [RESC1608X50N]  (value not drawn)
R_MOSI  CRCW060310K0FKEB  [RESC1608X50N]  (value not drawn)
R_WP  CRCW060310K0FKEB  [RESC1608X50N]  (value not drawn)
Rk  CAT16A-1002F4LF  [CAT16A1002F4LF]  (value not drawn)

### Ports
A0_A (in), A0_B (in), A1_A (in), A1_B (in), A2_A (in), A2_B (in), A3_A (in), A3_B (in), A4_A (in), A4_B (in), A5_A (in), A5_B (in), A6_A (in), A6_B (in), A7_A (in), A7_B (in), A8_A (in), A8_B (in), A9_A (in), A9_B (in), A10_A (in), A10_B (in), A11_A (in), A11_B (in), A12_A (in), A12_B (in), A13_A (in), A13_B (in), A14_A (in), A14_B (in), A15_A (in), A15_B (in), A16_A (in), A16_B (in), A17_A (in), A17_B (in), A18_A (in), A18_B (in), A19_A (in), A19_B (in), A20_A (in), A20_B (in), A21_A (in), A21_B (in), AUX_0, AUX_1, AUX_2, AUX_3, CLOCK_FPGA (in), D0_A_FromBUS (in), D0_A_ToBUS (in), D0_B_FromBUS (in), D0_B_ToBUS (in), D1_A_FromBUS (in), D1_A_ToBUS (in), D1_B_FromBUS (in), D1_B_ToBUS (in), D2_A_FromBUS (in), D2_A_ToBUS (in), D2_B_FromBUS (in), D2_B_ToBUS (in), D3_A_FromBUS (in), D3_A_ToBUS (in), D3_B_FromBUS (in), D3_B_ToBUS (in), D4_A_FromBUS (in), D4_A_ToBUS (in), D4_B_FromBUS (in), D4_B_ToBUS (in), D5_A_FromBUS (in), D5_A_ToBUS (in), D5_B_FromBUS (in), D5_B_ToBUS (in), D6_A_FromBUS (in), D6_A_ToBUS (in), D6_B_FromBUS (in), D6_B_ToBUS (in), D7_A_FromBUS (in), D7_A_ToBUS (in), D7_B_FromBUS (in), D7_B_ToBUS (in), D8_A_FromBUS (in), D8_A_ToBUS (in), D8_B_FromBUS (in), D8_B_ToBUS (in), D9_A_FromBUS (in), D9_A_ToBUS (in), D9_B_FromBUS (in), D9_B_ToBUS (in), D10_A_FromBUS (in), D10_A_ToBUS (in), D10_B_FromBUS (in), D10_B_ToBUS (in), D11_A_FromBUS (in), D11_A_ToBUS (in), D11_B_FromBUS (in), D11_B_ToBUS (in), D12_A_FromBUS (in), D12_A_ToBUS (in), D12_B_FromBUS (in), D12_B_ToBUS (in), D13_A_FromBUS (in), D13_A_ToBUS (in), D13_B_FromBUS (in), D13_B_ToBUS (in), D14_A_FromBUS (in), D14_A_ToBUS (in), D14_B_FromBUS (in), D14_B_ToBUS (in), D15_A_FromBUS (in), D15_A_ToBUS (in), D15_B_FromBUS (in), D15_B_ToBUS (in), D16_A_FromBUS (in), D16_A_ToBUS (in), D16_B_FromBUS (in), D16_B_ToBUS (in), D17_A_FromBUS (in), D17_A_ToBUS (in), D17_B_FromBUS (in), D17_B_ToBUS (in), D18_A_FromBUS (in), D18_A_ToBUS (in), D18_B_FromBUS (in), D18_B_ToBUS (in), D19_A_FromBUS (in), D19_A_ToBUS (in), D19_B_FromBUS (in), D19_B_ToBUS (in), D20_A_FromBUS (in), D20_A_ToBUS (in), D20_B_FromBUS (in), D20_B_ToBUS (in), D21_A_FromBUS (in), D21_A_ToBUS (in), D21_B_FromBUS (in), D21_B_ToBUS (in), D22_A_FromBUS (in), D22_A_ToBUS (in), D22_B_FromBUS (in), D22_B_ToBUS (in), D23_A_FromBUS (in), D23_A_ToBUS (in), D23_B_FromBUS (in), D23_B_ToBUS (in), DataID_0 (in), DataID_1 (in), INT (out), INT_A (out), INT_BUS (in), LOCK (in), M_IO (in), MAIN_RESET (in), MISO (in), MOSI (out), Msync (in), R_W (in), R_W_Internal (out), Reset (out), RESET_N (in), ROM_CSn (out), RTC_CLOCK (in), RTC_CSn (out), RTC_IRQ (in), RX_S1 (in), RX_S2 (in), SCLK (out), SD_CSn (out), SDRAM_0 (bidir), SDRAM_1 (bidir), SDRAM_2 (bidir), SDRAM_3 (bidir), SDRAM_4 (bidir), SDRAM_5 (bidir), SDRAM_6 (bidir), SDRAM_7 (bidir), SDRAM_8 (bidir), SDRAM_9 (bidir), SDRAM_10 (bidir), SDRAM_11 (bidir), SDRAM_12 (bidir), SDRAM_13 (bidir), SDRAM_14 (bidir), SDRAM_15 (bidir), SDRAM_16 (bidir), SDRAM_17 (bidir), SDRAM_18 (bidir), SDRAM_19 (bidir), SDRAM_20 (bidir), SDRAM_21 (bidir), SDRAM_22 (bidir), SDRAM_23 (bidir), SDRAM_24 (bidir), SDRAM_25 (bidir), SDRAM_26 (bidir), SDRAM_27 (bidir), SDRAM_28 (bidir), SDRAM_29 (bidir), SDRAM_30 (bidir), SDRAM_31 (bidir), SDRAM_32 (bidir), SDRAM_33 (bidir), SDRAM_34 (bidir), SDRAM_35 (bidir), SDRAM_36 (bidir), SDRAM_37 (bidir), SDRAM_38 (bidir), SDRAM_39 (bidir), SDRAM_40 (bidir), SDRAM_41 (bidir), SDRAM_42 (bidir), SDRAM_43 (bidir), SDRAM_44 (bidir), SDRAM_45 (bidir), SDRAM_46 (bidir), SDRAM_47 (bidir), SDRAM_A0 (in), SDRAM_A1 (in), SDRAM_A2 (in), SDRAM_A3 (in), SDRAM_A4 (in), SDRAM_A5 (in), SDRAM_A6 (in), SDRAM_A7 (in), SDRAM_A8 (in), SDRAM_A9 (in), SDRAM_A10 (in), SDRAM_A11 (in), SDRAM_A12 (in), SDRAM_BA0 (in), SDRAM_BA1 (in), SDRAM_CASn (out), SDRAM_CKE (out), SDRAM_CLK (out), SDRAM_CSn (in), SDRAM_LDQM (out), SDRAM_RASn (out), SDRAM_UDQM (out), SDRAM_WEn (in), Ssync (out), TX_S1 (out), TX_S2 (out), VCC_1V2 (in), VCCA_PLL (in), VDD (in), VDD (out), Wait (in)

### Nets
GND: C_IO0.1 C_IO1.1 C_IO2.1 C_IO3.1 C_IO4.1 C_IO5.1 C_IO6.1 C_IO7.1 C_IO8.1 C_IO9.1 C_IO10.1 C_IO11.1 C_ROM.1 C_VCC0.1 C_VCC1.1 C_VCC2.1 C_VCC3.1 C_VCC4.1 C_VCC5.1 C_VCC6.1 C_VCC7.1 C_Vcc8.1 CFG.6 EROM.4(GND) Lassye3.A1(GND) Lassye3.A22(GND) Lassye3.AB1(GND) Lassye3.AB22(GND) Lassye3.B4(GND) Lassye3.B12(GND) Lassye3.D4(GND) Lassye3.D7(GND) Lassye3.D13(GND) Lassye3.D16(GND) Lassye3.E18(GND) Lassye3.E20(GND) Lassye3.F22(GND) Lassye3.H2(GND) Lassye3.H5(GND) Lassye3.H15(GND) Lassye3.H17(GND) Lassye3.H22(GND) Lassye3.J10(GND) Lassye3.J12(GND) Lassye3.J14(GND) Lassye3.J20(GND) Lassye3.K9(GND) Lassye3.K11(GND) Lassye3.K13(GND) Lassye3.K16(GND) Lassye3.K17(DDR_VREF) Lassye3.K18(GND) Lassye3.L8(GND) Lassye3.L10(GND) Lassye3.L12(GND) Lassye3.L14(GND) Lassye3.M2(GND) Lassye3.M5(GND) Lassye3.M9(GND) Lassye3.M11(GND) Lassye3.M13(GND) Lassye3.N8(GND) Lassye3.N10(GND) Lassye3.N12(GND) Lassye3.N14(GND) Lassye3.N16(GND) Lassye3.N18(GND) Lassye3.N20(GND) Lassye3.N22(GND) Lassye3.P9(GND) Lassye3.P11(GND) Lassye3.P13(GND) Lassye3.T2(GND) Lassye3.T5(GND) Lassye3.T7(GND) Lassye3.T16(GND) Lassye3.T18(GND) Lassye3.U20(GND) Lassye3.U22(GND) Lassye3.W13(GND) Lassye3.W18(GND) Lassye3.Y2(GND) Lassye3.Y5(GND) Lassye3.Y8(GND) Lassye3.Y11(GND) Lassye3.Y15(GND) Lassye3.Y20(GND)
A0_A: Lassye3.A15(GPIOT_RXN18_EXTFB1) ; port A0_A
A0_B: Lassye3.A16(GPIOT_RXP20) ; port A0_B
A1_A: Lassye3.A17(GPIOT_RXP21) ; port A1_A
A1_B: Lassye3.A20(GPIOR_174_CLK15) ; port A1_B
A2_A: Lassye3.B14(GPIOT_RXP15) ; port A2_A
A2_B: Lassye3.B15(GPIOT_RXP18_EXTFB1) ; port A2_B
A3_A: Lassye3.B16(GPIOT_RXN20) ; port A3_A
A3_B: Lassye3.B17(GPIOT_RXN21) ; port A3_B
A4_A: Lassye3.B19(GPIOR_172_CTRL13) ; port A4_A
A4_B: Lassye3.B20(GPIOR_175_CLK14) ; port A4_B
A5_A: Lassye3.B22(GPIOR_180_CLK9) ; port A5_A
A5_B: Lassye3.C15(GPIOT_RXN23) ; port A5_B
A6_A: Lassye3.C16(GPIOT_RXP23) ; port A6_A
A6_B: Lassye3.C18(GPIOR_166_PLLIN0) ; port A6_B
A7_A: Lassye3.C19(GPIOR_171_CTRL14) ; port A7_A
A7_B: Lassye3.C21(GPIOR_178_CLK11) ; port A7_B
A8_A: Lassye3.D15(GPIOT_RXN22) ; port A8_A
A8_B: Lassye3.D19(GPIOR_173_CTRL12) ; port A8_B
A9_A: Lassye3.D20(GPIOR_179_CLK10) ; port A9_A
A9_B: Lassye3.D21(GPIOR_184_CTRL9) ; port A9_B
A10_A: Lassye3.C22(GPIOR_182_CTRL11) ; port A10_A
A10_B: Lassye3.D22(GPIOR_183_CTRL10) ; port A10_B
A11_A: Lassye3.E14(GPIOT_RXP19_CLKP1) ; port A11_A
A11_B: Lassye3.E15(GPIOT_RXP22) ; port A11_B
A12_A: Lassye3.E16(GPIOT_RXN28_EXTFB2) ; port A12_A
A12_B: Lassye3.E19(GPIOR_170_CTRL15) ; port A12_B
A13_A: Lassye3.E21(GPIOR_181_CLK8) ; port A13_A
A13_B: Lassye3.E22(GPIOR_185_CTRL8) ; port A13_B
A14_A: Lassye3.F15(GPIOT_RXN24) ; port A14_A
A14_B: Lassye3.F16(GPIOT_RXP28_EXTFB2) ; port A14_B
A15_A: Lassye3.F17(GPIOT_RXN29_CLKN2) ; port A15_A
A15_B: Lassye3.G15(GPIOT_RXP24) ; port A15_B
A16_A: Lassye3.G17(GPIOT_RXP29_CLKP2) ; port A16_A
A16_B: Lassye3.H16(GPIOT_RXN27) ; port A16_B
A17_A: Lassye3.J16(GPIOT_RXP27) ; port A17_A
A17_B: Lassye3.R15(GPIOB_RXN21) ; port A17_B
A18_A: Lassye3.T15(GPIOB_RXP21) ; port A18_A
A18_B: Lassye3.V15(GPIOB_RXP29_CLKP2) ; port A18_B
A19_A: Lassye3.W15(GPIOB_RXN29_CLKN2) ; port A19_A
A19_B: Lassye3.T12(GPIOB_RXN09_CLKN0) ; port A19_B
A20_A: Lassye3.AA15(GPIOB_RXN20) ; port A20_A
A20_B: Lassye3.AB15(GPIOB_RXP14) ; port A20_B
A21_A: Lassye3.AA16(GPIOB_RXP20) ; port A21_A
A21_B: Lassye3.AB16(GPIOB_RXP28_EXTFB2) ; port A21_B
AUX_0: Lassye3.C11(GPIOT_RXP04) ; port AUX_0
AUX_1: Lassye3.C13(GPIOT_RXN13) ; port AUX_1
AUX_2: Lassye3.A14(GPIOT_RXN15) ; port AUX_2
AUX_3: Lassye3.B13(GPIOT_RXP13) ; port AUX_3
BA0: Lassye3.AA11(GPIOB_RXN00) ; port SDRAM_BA0
BA1: Lassye3.AA12(GPIOB_RXP05) ; port SDRAM_BA1
CASn: Lassye3.AA8(GPIOB_TXN22) ; port SDRAM_CASn
CBUS_0: Lassye3.U4(GPIOL_11_CBUS0) Rk.3
CBUS_1: Lassye3.U6(GPIOL_12_CBUS1) Rk.2
CBUS_2: Lassye3.T4(GPIOL_13_CBUS2) Rk.1
CDONE: Lassye3.V5(CDONE) R_CDONE.2
CKE: Lassye3.AA5(GPIOB_TXP08_CDI21) ; port SDRAM_CKE
ClockFPGA: Lassye3.M6(GPIOL_66_CLK0) Lassye3.R4(GPIOL_19_PLLIN1) ; port CLOCK_FPGA
CSn: Lassye3.AA10(GPIOB_TXN26) ; port SDRAM_CSn
D0_A_FromBUS: Lassye3.C3(GPIOT_TXP03) ; port D0_A_FromBUS
D0_A_ToBUS: Lassye3.A5(GPIOT_TXP07) ; port D0_A_ToBUS
D0_B_FromBUS: Lassye3.C4(GPIOT_TXN03) ; port D0_B_FromBUS
D0_B_ToBUS: Lassye3.A6(GPIOT_TXP12) ; port D0_B_ToBUS
D1_A_FromBUS: Lassye3.C6(GPIOT_TXP10) ; port D1_A_FromBUS
D1_A_ToBUS: Lassye3.A7(GPIOT_TXP14) ; port D1_A_ToBUS
D1_B_FromBUS: Lassye3.C7(GPIOT_TXN10) ; port D1_B_FromBUS
D1_B_ToBUS: Lassye3.A19(GPIOR_169_MREFCLK) ; port D1_B_ToBUS
D2_A_FromBUS: Lassye3.D2(GPIOT_TXP02) ; port D2_A_FromBUS
D2_A_ToBUS: Lassye3.B5(GPIOT_TXN07) ; port D2_A_ToBUS
D2_B_FromBUS: Lassye3.D9(GPIOT_TXN21) ; port D2_B_FromBUS
D2_B_ToBUS: Lassye3.B6(GPIOT_TXN12) ; port D2_B_ToBUS
D3_A_FromBUS: Lassye3.D10(GPIOT_TXP24) ; port D3_A_FromBUS
D3_A_ToBUS: Lassye3.B7(GPIOT_TXN14) ; port D3_A_ToBUS
D3_B_FromBUS: Lassye3.D11(GPIOT_RXN02) ; port D3_B_FromBUS
D3_B_ToBUS: Lassye3.D18(GPIOR_168_PLLIN2) ; port D3_B_ToBUS
D4_A_FromBUS: Lassye3.D14(GPIOT_RXN19_CLKN1) ; port D4_A_FromBUS
D4_A_ToBUS: Lassye3.E11(GPIOT_RXP02) ; port D4_A_ToBUS
D4_B_FromBUS: Lassye3.E2(GPIOL_157_CBSEL1) ; port D4_B_FromBUS
D4_B_ToBUS: Lassye3.E12(GPIOT_RXN09_CLKN0) ; port D4_B_ToBUS
D5_A_FromBUS: Lassye3.E3(GPIOL_160_PLLIN1) ; port D5_A_FromBUS
D5_A_ToBUS: Lassye3.E13(GPIOT_RXN14) ; port D5_A_ToBUS
D5_B_FromBUS: Lassye3.E4(GPIOL_164_PLLIN0) ; port D5_B_FromBUS
D5_B_ToBUS: Lassye3.H12(GPIOT_RXP08_EXTFB0) ; port D5_B_ToBUS
D6_A__FromBUS: Lassye3.E5(GPIOL_162_EXTFB) ; port D6_A_FromBUS
D6_A_ToBUS: Lassye3.H13(GPIOT_RXP12) ; port D6_A_ToBUS
D6_B_FromBUS: Lassye3.E6(GPIOT_TXN11) ; port D6_B_FromBUS
D6_B_ToBUS: Lassye3.H14(GPIOT_RXN16) ; port D6_B_ToBUS
D7_A_FromBUS: Lassye3.E7(GPIOT_TXP13) ; port D7_A_FromBUS
D7_A_ToBUS: Lassye3.J2(GPIOL_117) ; port D7_A_ToBUS
D7_B_FromBUS: Lassye3.E8(GPIOT_TXP16) ; port D7_B_FromBUS
D7_B_ToBUS: Lassye3.J3(GPIOL_91) ; port D7_B_ToBUS
D8_A_FromBUS: Lassye3.E9(GPIOT_TXP21) ; port D8_A_FromBUS
D8_A_ToBUS: Lassye3.J4(GPIOL_88) ; port D8_A_ToBUS
D8_B_FromBUS: Lassye3.E10(GPIOT_TXN24) ; port D8_B_FromBUS
D8_B_ToBUS: Lassye3.J5(GPIOL_85) ; port D8_B_ToBUS
D9_A_FromBUS: Lassye3.F4(GPIOL_156_CBSEL0) ; port D9_A_FromBUS
D9_A_ToBUS: Lassye3.J7(GPIOL_115) ; port D9_A_ToBUS
D9_B_FromBUS: Lassye3.F5(GPIOL_150_NSTATUS) ; port D9_B_FromBUS
D9_B_ToBUS: Lassye3.J8(GPIOL_116) ; port D9_B_ToBUS
D10_A_FromBUS: Lassye3.F6(GPIOT_TXP11) ; port D10_A_FromBUS
D10_A_ToBUS: Lassye3.K2(GPIOL_89) ; port D10_A_ToBUS
D10_B_FromBUS: Lassye3.F7(GPIOT_TXN13) ; port D10_B_FromBUS
D10_B_ToBUS: Lassye3.K4(GPIOL_79) ; port D10_B_ToBUS
D11_A_FromBUS: Lassye3.F8(GPIOT_TXN16) ; port D11_A_FromBUS
D11_A_ToBUS: Lassye3.K5(GPIOL_81) ; port D11_A_ToBUS
D11_B_FromBUS: Lassye3.F10(GPIOT_TXP26) ; port D11_B_FromBUS
D11_B_ToBUS: Lassye3.K6(GPIOL_77_CTRL7) ; port D11_B_ToBUS
D12_A_FromBUS: Lassye3.F12(GPIOT_RXP09_CLKP0) ; port D12_A_FromBUS
D12_A_ToBUS: Lassye3.K7(GPIOL_76_CTRL6) ; port D12_A_ToBUS
D12_B_FromBUS: Lassye3.F13(GPIOT_RXP14) ; port D12_B_FromBUS
D12_B_ToBUS: Lassye3.K8(GPIOL_75_CTRL5) ; port D12_B_ToBUS
D13_A_FromBUS: Lassye3.G1(GPIOL_136) ; port D13_A_FromBUS
D13_A_ToBUS: Lassye3.K15(GPIOR_188_PLLIN2) ; port D13_A_ToBUS
D13_B_FromBUS: Lassye3.G2(GPIOL_142) ; port D13_B_FromBUS
D13_B_ToBUS: Lassye3.L1(GPIOL_68_CLK2) ; port D13_B_ToBUS
D14_A_FromBUS: Lassye3.G3(GPIOL_141) ; port D14_A_FromBUS
D14_A_ToBUS: Lassye3.L2(GPIOL_69_CLK3) ; port D14_A_ToBUS
D14_B_FromBUS: Lassye3.G4(GPIOL_138) ; port D14_B_FromBUS
D14_B_ToBUS: Lassye3.L3(GPIOL_73_CLK7) ; port D14_B_ToBUS
D15_A_FromBUS: Lassye3.G5(GPIOL_147) ; port D15_A_FromBUS
D15_A_ToBUS: Lassye3.L4(GPIOL_74_CTRL4) ; port D15_A_ToBUS
D15_B_FromBUS: Lassye3.G6(GPIOL_134) ; port D15_B_FromBUS
D15_B_ToBUS: Lassye3.L5(GPIOL_71_CLK5) ; port D15_B_ToBUS
D16_A_FromBUS: Lassye3.G7(GPIOT_TXP15) ; port D16_A_FromBUS
D16_A_ToBUS: Lassye3.L6(GPIOL_72_CLK6) ; port D16_A_ToBUS
D16_B_FromBUS: Lassye3.G8(GPIOT_TXN20) ; port D16_B_FromBUS
D16_B_ToBUS: Lassye3.L7(GPIOL_70_CLK4) ; port D16_B_ToBUS
D17_A_FromBUS: Lassye3.G9(GPIOT_TXP22) ; port D17_A_FromBUS
D17_A_ToBUS: Lassye3.L15(GPIOR_187_PLLIN1) ; port D17_A_ToBUS
D17_B_FromBUS: Lassye3.G10(GPIOT_TXN26) ; port D17_B_FromBUS
D17_B_ToBUSù: Lassye3.M1(GPIOL_65_CTRL3) ; port D17_B_ToBUS
D18_A_FromBUS: Lassye3.G11(GPIOT_RXP03) ; port D18_A_FromBUS
D18_A_ToBUS: Lassye3.M3(GPIOL_67_CLK1) ; port D18_A_ToBUS
D18_B_FromBUS: Lassye3.G12(GPIOT_RXN08_EXTFB0) ; port D18_B_FromBUS
D18_B_ToBUS: Lassye3.M4(GPIOL_64_CTRL2) ; port D18_B_ToBUS
D19_A_FromBUS: Lassye3.G13(GPIOT_RXN12) ; port D19_A_FromBUS
D19_A_ToBUS: Lassye3.M7(GPIOL_58) ; port D19_A_ToBUS
D19_B_FromBUS: Lassye3.G14(GPIOT_RXP16) ; port D19_B_FromBUS
D19_B_ToBUS: Lassye3.M15(GPIOR_186_PLLIN0) ; port D19_B_ToBUS
D20_A_FromBUS: Lassye3.H1(GPIOL_133) ; port D20_A_FromBUS
D20_A_ToBUS: Lassye3.N1(GPIOL_62_CTRL0) ; port D20_A_ToBUS
D20_B_FromBUS: Lassye3.H3(GPIOL_131) ; port D20_B_FromBUS
D20_B_ToBUS: Lassye3.N2(GPIOL_63_CTRL1) ; port D20_B_ToBUS
D21_A_FromBUS: Lassye3.H4(GPIOL_121) ; port D21_A_FromBUS
D21_A_ToBUS: Lassye3.N4(GPIOL_56) ; port D21_A_ToBUS
D21_B_FromBUS: Lassye3.H6(GPIOL_123) ; port D21_B_FromBUS
D21_B_ToBUS: Lassye3.N5(GPIOL_53) ; port D21_B_ToBUS
D22_A_FromBUS: Lassye3.H7(GPIOT_TXN15) ; port D22_A_FromBUS
D22_A_ToBUS: Lassye3.N7(GPIOL_40) ; port D22_A_ToBUS
D22_B_ToBUS: Lassye3.P5(GPIOL_47) ; port D22_B_ToBUS
D23_A_ToBUS: Lassye3.P6(GPIOL_45) ; port D23_A_ToBUS
D23_B_FromBUS: Lassye3.H11(GPIOT_RXN03) ; port D23_B_FromBUS
D23_B_ToBUS: Lassye3.P7(GPIOL_24_CDI7) ; port D23_B_ToBUS
DataID_0: Lassye3.B11(GPIOT_RXN01) ; port DataID_0
DataID_1: Lassye3.B10(GPIOT_TXN25) ; port DataID_1
HOLD: EROM.7(IO3) R_Hold.1
INT: Lassye3.B9(GPIOT_TXN23) ; port INT
INT_A: Lassye3.B8(GPIOT_TXP18) ; port INT_A
INTn: Lassye3.K1(GPIOL_87) ; off-sheet INTn
LOCK: Lassye3.C12(GPIOT_RXN04) ; port LOCK
M_IO: Lassye3.A11(GPIOT_RXP01) ; port M_IO
MAIN_RESET: Lassye3.R8(GPIOL_16_CDI3) ; port MAIN_RESET
MISO: Lassye3.A4(GPIOT_TXP06) ; port MISO
MOSI: Lassye3.A2(GPIOT_TXP05) ; port MOSI
MSync: Lassye3.A9(GPIOT_TXP23) ; port Msync
R_W: Lassye3.A8(GPIOT_TXN18) ; port R_W
R_W_Internal: Lassye3.D1(GPIOT_TXP01) ; port R_W_Internal
RAM_CLK: Lassye3.AA6(GPIOB_TXN14_CDI16) ; port SDRAM_CLK
RASn: Lassye3.AA7(GPIOB_TXN16_CDI12) ; port SDRAM_RASn
Reset: Lassye3.A12(GPIOT_RXP11) ; port Reset
RESET_N: Lassye3.V4(CRESET_N) ; port RESET_N
ROM_CSn: Lassye3.A21(GPIOR_176_CLK13) ; port ROM_CSn
RTC_CLOCK: Lassye3.R12(GPIOB_RXP09_CLKP0) ; port RTC_CLOCK
RTC_CSn: Lassye3.B21(GPIOR_177_CLK12) ; port RTC_CSn
RTC_IRQ: Lassye3.A18(GPIOR_167_PLLIN1) ; port RTC_IRQ
RX_S1: Lassye3.B1(GPIOT_TXN04) ; port RX_S1
RX_S2: Lassye3.C1(GPIOT_TXP04) ; port RX_S2
SCLK: Lassye3.A3(GPIOT_TXN06) ; port SCLK
SCS: Lassye3.J1(GPIOL_119) ; off-sheet SCS
SD_CSn: Lassye3.E1(GPIOT_TXN01) ; port SD_CSn
SDRAM_A1: Lassye3.AA1(GPIOB_TXP05_CDI27) ; port SDRAM_A1
SDRAM_A2: Lassye3.AA2(GPIOB_TXN06_CDI24) ; port SDRAM_A2
SPI_CLK: EROM.6(CLK) Lassye3.W1(GPIOL_01_CCK)
SPI_MISO: EROM.2(DO_(IO1)) Lassye3.V1(GPIOL_09_CDI1) R_MISO.1
SPI_MOSI: EROM.5(DI_(IO0)) Lassye3.V2(GPIOL_08_CDI0) R_MOSI.1
SPI_SS: EROM.1(/CS) Lassye3.V3(GPIOL_00_SS_N) R_CS.1
SSync: Lassye3.A10(GPIOT_TXP25) ; port Ssync
TCK: CFG.2 Lassye3.T1(TCK)
TDI: CFG.5 Lassye3.U2(TDI)
TDO: CFG.3 Lassye3.T3(TDO)
Test_N: Lassye3.F1(GPIOL_151_TEST_N) Rk.4
TMS: CFG.4 Lassye3.U1(TMS)
TX_S1: Lassye3.B2(GPIOT_TXN05) ; port TX_S1
TX_S2: Lassye3.C2(GPIOT_TXN02) ; port TX_S2
VCC_1V2: C_VCC0.2 C_VCC1.2 C_VCC2.2 C_VCC3.2 C_VCC4.2 C_VCC5.2 C_VCC6.2 C_VCC7.2 C_Vcc8.2 Lassye3.H10(VCC) Lassye3.J9(VCC) Lassye3.J11(VCC) Lassye3.J13(VCC) Lassye3.J15(VCC) Lassye3.K10(VCC) Lassye3.K12(VCC) Lassye3.K14(VCC) Lassye3.L9(VCC) Lassye3.L11(VCC) Lassye3.L13(VCC) Lassye3.M8(VCC) Lassye3.M10(VCC) Lassye3.M12(VCC) Lassye3.M14(VCC) Lassye3.N9(VCC) Lassye3.N11(VCC) Lassye3.N13(VCC) Lassye3.P10(VCC) Lassye3.P12(VCC) Lassye3.P14(VCC) Lassye3.R11(VCC) ; port VCC_1V2
VCCA_PLL: Lassye3.D5(VCCA_TL) Lassye3.D17(VCCA_TR) Lassye3.E17(VCCA_TR) Lassye3.N15(VCCA_BR) Lassye3.P15(VCCA_BR) Lassye3.W5(VCCA_BL) ; port VCCA_PLL
VDD: C_IO0.2 C_IO1.2 C_IO2.2 C_IO3.2 C_IO4.2 C_IO5.2 C_IO6.2 C_IO7.2 C_IO8.2 C_IO9.2 C_IO10.2 C_IO11.2 C_ROM.2 CFG.1 EROM.8(VCC) Lassye3.AA4(VCCIO4F) Lassye3.AA14(VCCIO4B) Lassye3.B3(VCCIO2A) Lassye3.B18(VCCIO3D_TR_BR) Lassye3.C8(VCCIO2B) Lassye3.C9(VCCIO2C) Lassye3.C14(VCCIO2E) Lassye3.C17(VCCIO2F) Lassye3.C20(VCCIO3D_TR_BR) Lassye3.D3(VCCIO2A) Lassye3.D6(VCCIO2B) Lassye3.D12(VCCIO2D) Lassye3.F2(VCCIO1F_1G) Lassye3.F3(VCCIO1F_1G) Lassye3.F9(VCCIO2C) Lassye3.F11(VCCIO2D) Lassye3.F14(VCCIO2E) Lassye3.G16(VCCIO2F) Lassye3.J6(VCCIO1D_1E) Lassye3.K3(VCCIO1D_1E) Lassye3.N3(VCCIO1B_1C) Lassye3.N6(VCCIO1B_1C) Lassye3.R5(VCCIO1B_1C) Lassye3.R9(VCCIO4E) Lassye3.T9(VCCIO4D) Lassye3.T11(VCCIO4C) Lassye3.U3(VCCIO1A) Lassye3.U15(VCCIO4A) Lassye3.V13(VCCIO4B) Lassye3.W7(VCCIO4E) Lassye3.Y3(VCCIO4F) Lassye3.Y9(VCCIO4D) Lassye3.Y12(VCCIO4C) Lassye3.Y16(VCCIO4A) R_CDONE.1 R_CS.2 R_CSI.2 R_Hold.2 R_MISO.2 R_MOSI.2 R_WP.2 Rk.5 Rk.6 Rk.7 Rk.8 ; port VDD
Wait: Lassye3.A13(GPIOT_RXN11) ; port Wait
WEn: Lassye3.AA9(GPIOB_TXN24) ; port SDRAM_WEn
NetEROM_3: EROM.3(IO2) R_WP.1
NetLassye3_AA13: Lassye3.AA13(GPIOB_RXN10) ; port SDRAM_A0
NetLassye3_AB2: Lassye3.AB2(GPIOB_TXP06_CDI25) ; port SDRAM_A3
NetLassye3_AB3: Lassye3.AB3(GPIOB_TXP07_CDI23) ; port SDRAM_A4
NetLassye3_AB4: Lassye3.AB4(GPIOB_TXN07_CDI22) ; port SDRAM_A5
NetLassye3_AB5: Lassye3.AB5(GPIOB_TXN08_CDI20) ; port SDRAM_A6
NetLassye3_AB6: Lassye3.AB6(GPIOB_TXP14_CDI17) ; port SDRAM_A7
NetLassye3_AB7: Lassye3.AB7(GPIOB_TXP16_CDI13) ; port SDRAM_A8
NetLassye3_AB8: Lassye3.AB8(GPIOB_TXP22) ; port SDRAM_A9
NetLassye3_AB9: Lassye3.AB9(GPIOB_TXP24) ; port SDRAM_A10
NetLassye3_AB10: Lassye3.AB10(GPIOB_TXP26) ; port SDRAM_A11
NetLassye3_AB11: Lassye3.AB11(GPIOB_RXP00) ; port SDRAM_0
NetLassye3_AB12: Lassye3.AB12(GPIOB_RXN05) ; port SDRAM_1
NetLassye3_AB13: Lassye3.AB13(GPIOB_RXP10) ; port SDRAM_2
NetLassye3_AB14: Lassye3.AB14(GPIOB_RXN14) ; port SDRAM_3
NetLassye3_AB17: Lassye3.AB17(GPIOB_RXN28_EXTFB2) ; port SDRAM_6
NetLassye3_H8: Lassye3.H8(GPIOT_TXP20) ; port D22_B_FromBUS
NetLassye3_H9: Lassye3.H9(GPIOT_TXN22) ; port D23_A_FromBUS
NetLassye3_P1: Lassye3.P1(GPIOL_52) ; port SDRAM_21
NetLassye3_P2: Lassye3.P2(GPIOL_50) ; port SDRAM_22
NetLassye3_P3: Lassye3.P3(GPIOL_51) ; port SDRAM_23
NetLassye3_P4: Lassye3.P4(GPIOL_36) ; port SDRAM_31
NetLassye3_P8: Lassye3.P8(GPIOL_22_CDI6) ; port INT_BUS
NetLassye3_R1: Lassye3.R1(GPIOL_49) ; port SDRAM_43
NetLassye3_R2: Lassye3.R2(GPIOL_15_PLLIN0) ; port SDRAM_44
NetLassye3_R3: Lassye3.R3(GPIOL_17_EXTFB0) ; port SDRAM_45
NetLassye3_R6: Lassye3.R6(GPIOL_20_CDI5) ; port SDRAM_46
NetLassye3_R7: Lassye3.R7(GPIOL_18_CDI4) ; port SDRAM_47
NetLassye3_R10: Lassye3.R10(GPIOB_RXN01) ; port SDRAM_A12
NetLassye3_T6: Lassye3.T6(GPIOL_14_CDI2) ; port SDRAM_40
NetLassye3_T8: Lassye3.T8(GPIOB_TXP18_CDI9) ; port SDRAM_41
NetLassye3_T10: Lassye3.T10(GPIOB_RXP01) ; port SDRAM_42
NetLassye3_T13: Lassye3.T13(GPIOB_RXP12) ; port SDRAM_4
NetLassye3_T14: Lassye3.T14(GPIOB_RXP18_EXTFB1) ; port SDRAM_5
NetLassye3_U7: Lassye3.U7(GPIOB_TXN15_CDI14) ; port SDRAM_32
NetLassye3_U8: Lassye3.U8(GPIOB_TXN18_CDI8) ; port SDRAM_33
NetLassye3_U9: Lassye3.U9(GPIOB_TXP23) ; port SDRAM_34
NetLassye3_U10: Lassye3.U10(GPIOB_TXN23) ; port SDRAM_35
NetLassye3_U11: Lassye3.U11(GPIOB_RXP06) ; port SDRAM_36
NetLassye3_U12: Lassye3.U12(GPIOB_RXN06) ; port SDRAM_37
NetLassye3_U13: Lassye3.U13(GPIOB_RXN12) ; port SDRAM_38
NetLassye3_U14: Lassye3.U14(GPIOB_RXN18_EXTFB1) ; port SDRAM_39
NetLassye3_V6: Lassye3.V6(GPIOL_04_CSI) R_CSI.1
NetLassye3_V7: Lassye3.V7(GPIOB_TXP15_CDI15) ; port SDRAM_24
NetLassye3_V8: Lassye3.V8(GPIOB_TXN17_CDI10) ; port SDRAM_25
NetLassye3_V9: Lassye3.V9(GPIOB_TXP19) ; port SDRAM_26
NetLassye3_V10: Lassye3.V10(GPIOB_TXN25) ; port SDRAM_27
NetLassye3_V11: Lassye3.V11(GPIOB_RXN03) ; port SDRAM_28
NetLassye3_V12: Lassye3.V12(GPIOB_RXP08_EXTFB0) ; port SDRAM_29
NetLassye3_V14: Lassye3.V14(GPIOB_RXP19_CLKP1) ; port SDRAM_30
NetLassye3_W2: Lassye3.W2(GPIOB_TXP04_CDI29) ; port SDRAM_12
NetLassye3_W3: Lassye3.W3(GPIOB_TXN04_CDI28) ; port SDRAM_13
NetLassye3_W4: Lassye3.W4(GPIOB_TXN03_CDI30) ; port SDRAM_14
NetLassye3_W8: Lassye3.W8(GPIOB_TXP17_CDI11) ; port SDRAM_15
NetLassye3_W9: Lassye3.W9(GPIOB_TXN19) ; port SDRAM_16
NetLassye3_W10: Lassye3.W10(GPIOB_TXP25) ; port SDRAM_17
NetLassye3_W11: Lassye3.W11(GPIOB_RXP03) ; port SDRAM_18
NetLassye3_W12: Lassye3.W12(GPIOB_RXN08_EXTFB0) ; port SDRAM_19
NetLassye3_W14: Lassye3.W14(GPIOB_RXN19_CLKN1) ; port SDRAM_20
NetLassye3_Y1: Lassye3.Y1(GPIOB_TXN05_CDI26) ; port SDRAM_7
NetLassye3_Y6: Lassye3.Y6(GPIOB_TXP13_CDI19) ; port SDRAM_8
NetLassye3_Y7: Lassye3.Y7(GPIOB_TXN13_CDI18) ; port SDRAM_9
NetLassye3_Y13: Lassye3.Y13(GPIOB_RXN16) ; port SDRAM_10
NetLassye3_Y14: Lassye3.Y14(GPIOB_RXP16) ; port SDRAM_11

Not connected (* = marked no-connect by the designer): Lassye3 AA3(REF_RES_4F) AA17(VCCIO_DDR) AA18(DDR_DQ[31]) AA19(VCCIO_DDR) AA20(DDR_DQ[26]) AA21(VCCIO_DDR) AA22(DDR_DQ[27]) AB18(DDR_DQ[30]) AB19(DDR_DQ[28]) AB20(DDR_DQS_N[3]) AB21(DDR_DQS[3]) C5(REF_RES_2A) C10(REF_RES_2C) D8(REF_RES_2B) F18(DDR_DQ[15]) F19(VCCIO_DDR) F20(DDR_DQ[14]) F21(VCCIO_DDR) G18(VCCIO_DDR) G19(DDR_DQ[12]) G20(DDR_DQS[1]) G21(DDR_DQS_N[1]) G22(DDR_DM[1]) H18(DDR_DQ[7]) H19(DDR_DQ[11]) H20(DDR_DQ[10]) H21(DDR_DQ[13]) J17(VCCIO_DDR) J18(DDR_DQ[5]) J19(VCCIO_DDR) J21(VCCIO_DDR) J22(DDR_DQ[8]) K19(DDR_DM[0]) K20(DDR_DQ[2]) K21(DDR_DQ[0]) K22(DDR_DQ[9]) L16(DDR_CKE) L17(DDR_A[1]) L18(DDR_DQ[6]) L19(DDR_DQ[4]) L20(DDR_DQ[3]) L21(DDR_DQS[0]) L22(DDR_DQS_N[0]) M16(DDR_CAS_N) M17(VCCIO_DDR) M18(DDR_A[0]) M19(VCCIO_DDR) M20(DDR_A[6]) M21(VCCIO_DDR) M22(DDR_DQ[1]) N17(DDR_A[2]) N19(DDR_A[4]) N21(DDR_CK) P16(DDR_CS_N) P17(DDR_A[7]) P18(DDR_ZQ) P19(DDR_A[8]) P20(DDR_A[3]) P21(DDR_CK_N) P22(DDR_A[10]) R13(GPIOB_RXN15) R14(GPIOB_RXP15) R16(DDR_RAS_N) R17(VCCIO_DDR) R18(DDR_A[14]) R19(VCCIO_DDR) R20(DDR_A[9]) R21(VCCIO_DDR) R22(DDR_A[11])* T17(DDR_BA[1]) T19(DDR_A[5]) T20(DDR_A[12]) T21(DDR_A[13]) T22(DDR_DQ[17]) U5(GPIOL_05_CSO)* U16(DDR_WE_N) U17(DDR_A[15]) U18(DDR_DQ[20]) U19(DDR_DQ[16]) U21(DDR_DQ[19]) V16(DDR_BA[0]) V17(VCCIO_DDR) V18(DDR_DQ[23]) V19(VCCIO_DDR) V20(DDR_DM[2]) V21(VCCIO_DDR) V22(DDR_DQS[2]) W6(REF_RES_4E) W16(DDR_BA[2]) W17(DDR_ODT) W19(DDR_DQ[22]) W20(DDR_DQ[21]) W21(DDR_DQ[18]) W22(DDR_DQS_N[2]) Y4(GPIOB_TXP03_CDI31) Y10(REF_RES_4D) Y17(DDR_RST_N) Y18(DDR_DQ[29]) Y19(DDR_DM[3]) Y21(DDR_DQ[24]) Y22(DDR_DQ[25])

### Notes on the sheet
- JTAG Connector
- (in symbol T120F484I4, part A) 1 of 8
- (in symbol T120F484I4, part B) 2 of 8
- (in symbol T120F484I4, part C) 3 of 8
- (in symbol T120F484I4, part D) 4 of 8
- (in symbol T120F484I4, part E) 5 of 8
- (in symbol T120F484I4, part F) 6 of 8
- (in symbol T120F484I4, part G) 7 of 8
- (in symbol T120F484I4, part H) 8 of 8

### Library data of the parts
C_IO0-C_IO11 C_VCC0-C_VCC7 C_Vcc8 = GRM155R71C104JA88J: Capacitor; Manufacturer_Name: Murata Electronics; Datasheet Link: https://datasheet.datasheetarchive.com/originals/distributors/DKDS-10/191304.pdf; Height: 0.55mm; Manufacturer_Part_Number: GRM155R71C104JA88J; Mouser Part Number: 81-GRM155R71C104JA8J; Mouser Price/Stock: https://www.mouser.co.uk/ProductDetail/Murata-Electronics/GRM155R71C104JA88J?qs=hNud%2FORuBR1FShEh%252B0yzMw%3D%3D; Arrow Part Number: GRM155R71C104JA88J; Arrow Price/Stock: https://www.arrow.com/en/products/grm155r71c104ja88j/murata-manufacturing?region=nac
C_ROM = 0603YC104K4T2A: Capacitor; Manufacturer_Name: AVX; Datasheet Link: http://www.mouser.com/catalog/supplier/library/pdf/AVXSurfaceMountCeramic.pdf; Height: 0.9mm; Manufacturer_Part_Number: 0603YC104K4T2A; Mouser Part Number: 581-0603YC104K4; Mouser Price/Stock: https://www.mouser.co.uk/ProductDetail/AVX/0603YC104K4T2A/?qs=Cej1j9ztgjHj4I01NaBI3A%3D%3D; Arrow Part Number: 0603YC104K4T2A; Arrow Price/Stock: https://www.arrow.com/en/products/0603yc104k4t2a/avx
CFG = Header 6: Header, 6-Pin; LatestRevisionDate: 17-Jul-2002; LatestRevisionNote: Re-released for DXP Platform.; Publisher: Altium Limited
EROM = W25Q32JVSSIQ: Integrated Circuit; Manufacturer_Name: Winbond; Datasheet Link: https://www.winbond.com/hq/search-resource-file.jsp?partNo=W25Q32JVSSIQ&type=datasheet; Height: 2.16mm; Manufacturer_Part_Number: W25Q32JVSSIQ; Mouser Part Number: 454-W25Q32JVSSIQ; Mouser Price/Stock: https://www.mouser.co.uk/ProductDetail/Winbond/W25Q32JVSSIQ?qs=qSfuJ%252Bfl%2Fd4PGZSN0WxfCA%3D%3D; Arrow Part Number: W25Q32JVSSIQ; Arrow Price/Stock: https://www.arrow.com/en/products/w25q32jvssiq/winbond-electronics?region=nac
Lassye3 = T120F484I4: No Description Available; Mfr_Name: Efinix; RefDes: RefDes; Type: Type
R_CDONE R_CS R_CSI R_Hold R_MISO R_MOSI R_WP = CRCW060310K0FKEB: Resistor; Manufacturer_Name: Vishay; Datasheet Link: http://www.vishay.com/docs/20035/dcrcwe3.pdf; Height: 0.5mm; Manufacturer_Part_Number: CRCW060310K0FKEB; Mouser Part Number: 71-CRCW060310K0FKEB; Mouser Price/Stock: https://www.mouser.co.uk/ProductDetail/Vishay-Dale/CRCW060310K0FKEB?qs=KP%252BPudsHLdyVfHu6lav4Iw%3D%3D; Arrow Part Number: CRCW060310K0FKEB; Arrow Price/Stock: https://www.arrow.com/en/products/crcw060310k0fkeb/vishay
Rk = CAT16A-1002F4LF: Resistor Network; Manufacturer_Name: Bourns; Datasheet Link: https://www.bourns.com/docs/product-datasheets/cat16a-lf.pdf?sfvrsn=f78c48f6_4; Height: 0.65mm; Manufacturer_Part_Number: CAT16A-1002F4LF; Mouser Part Number: 652-CAT16A-1002F4LF; Mouser Price/Stock: https://www.mouser.co.uk/ProductDetail/Bourns/CAT16A-1002F4LF?qs=IS%252B4QmGtzzqwI8c1abvAYA%3D%3D

## Sheet AddressBUS.SchDoc
size A0; SheetNumber: 9; SheetTotal: 9
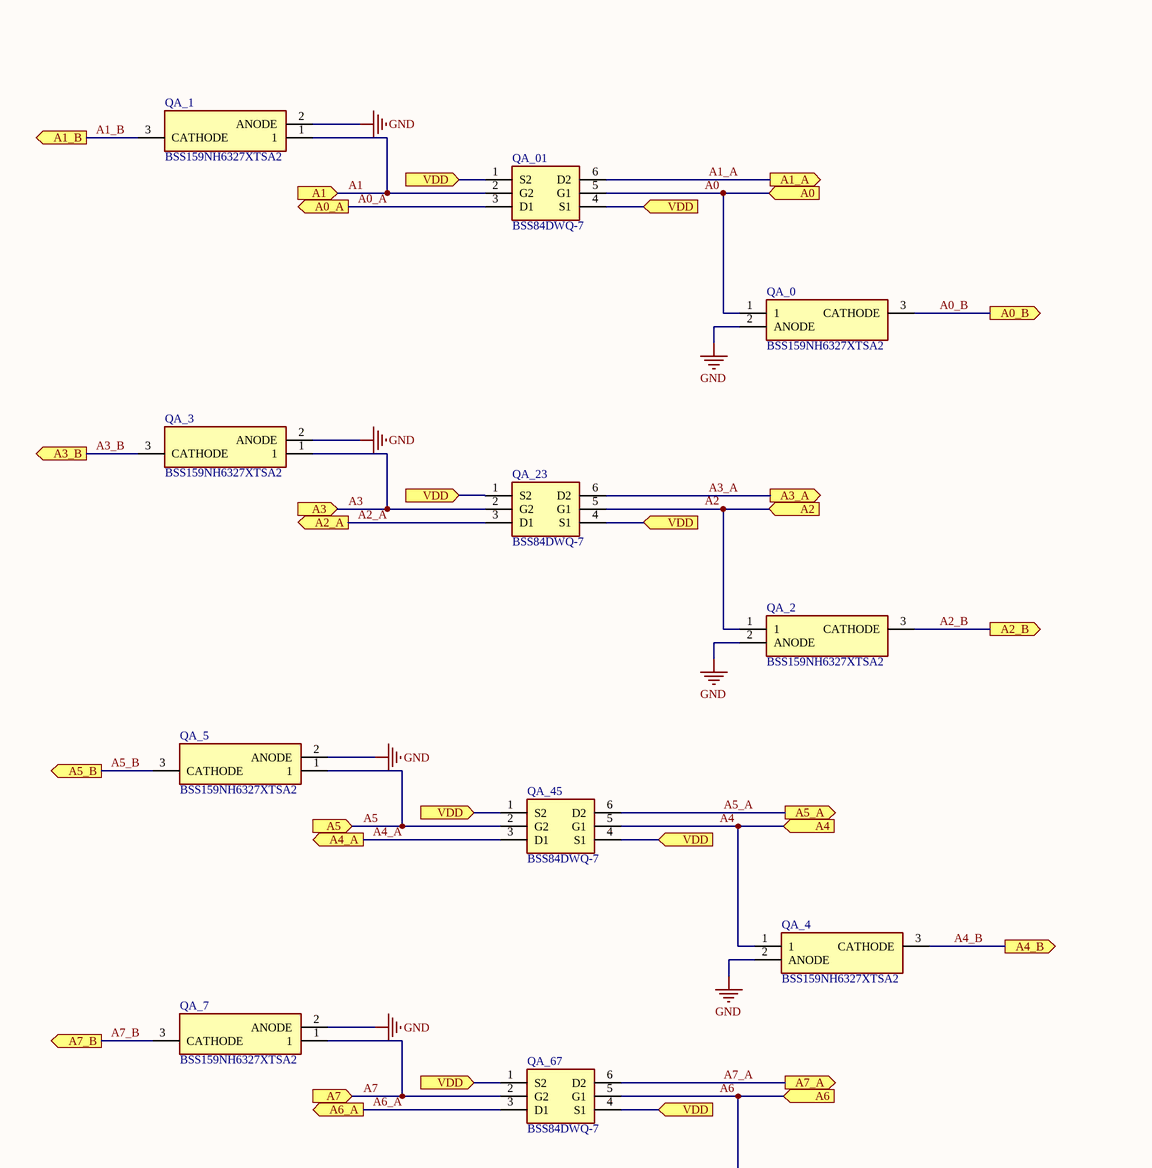
[diagram p14: AddressBUS.SchDoc, top left]
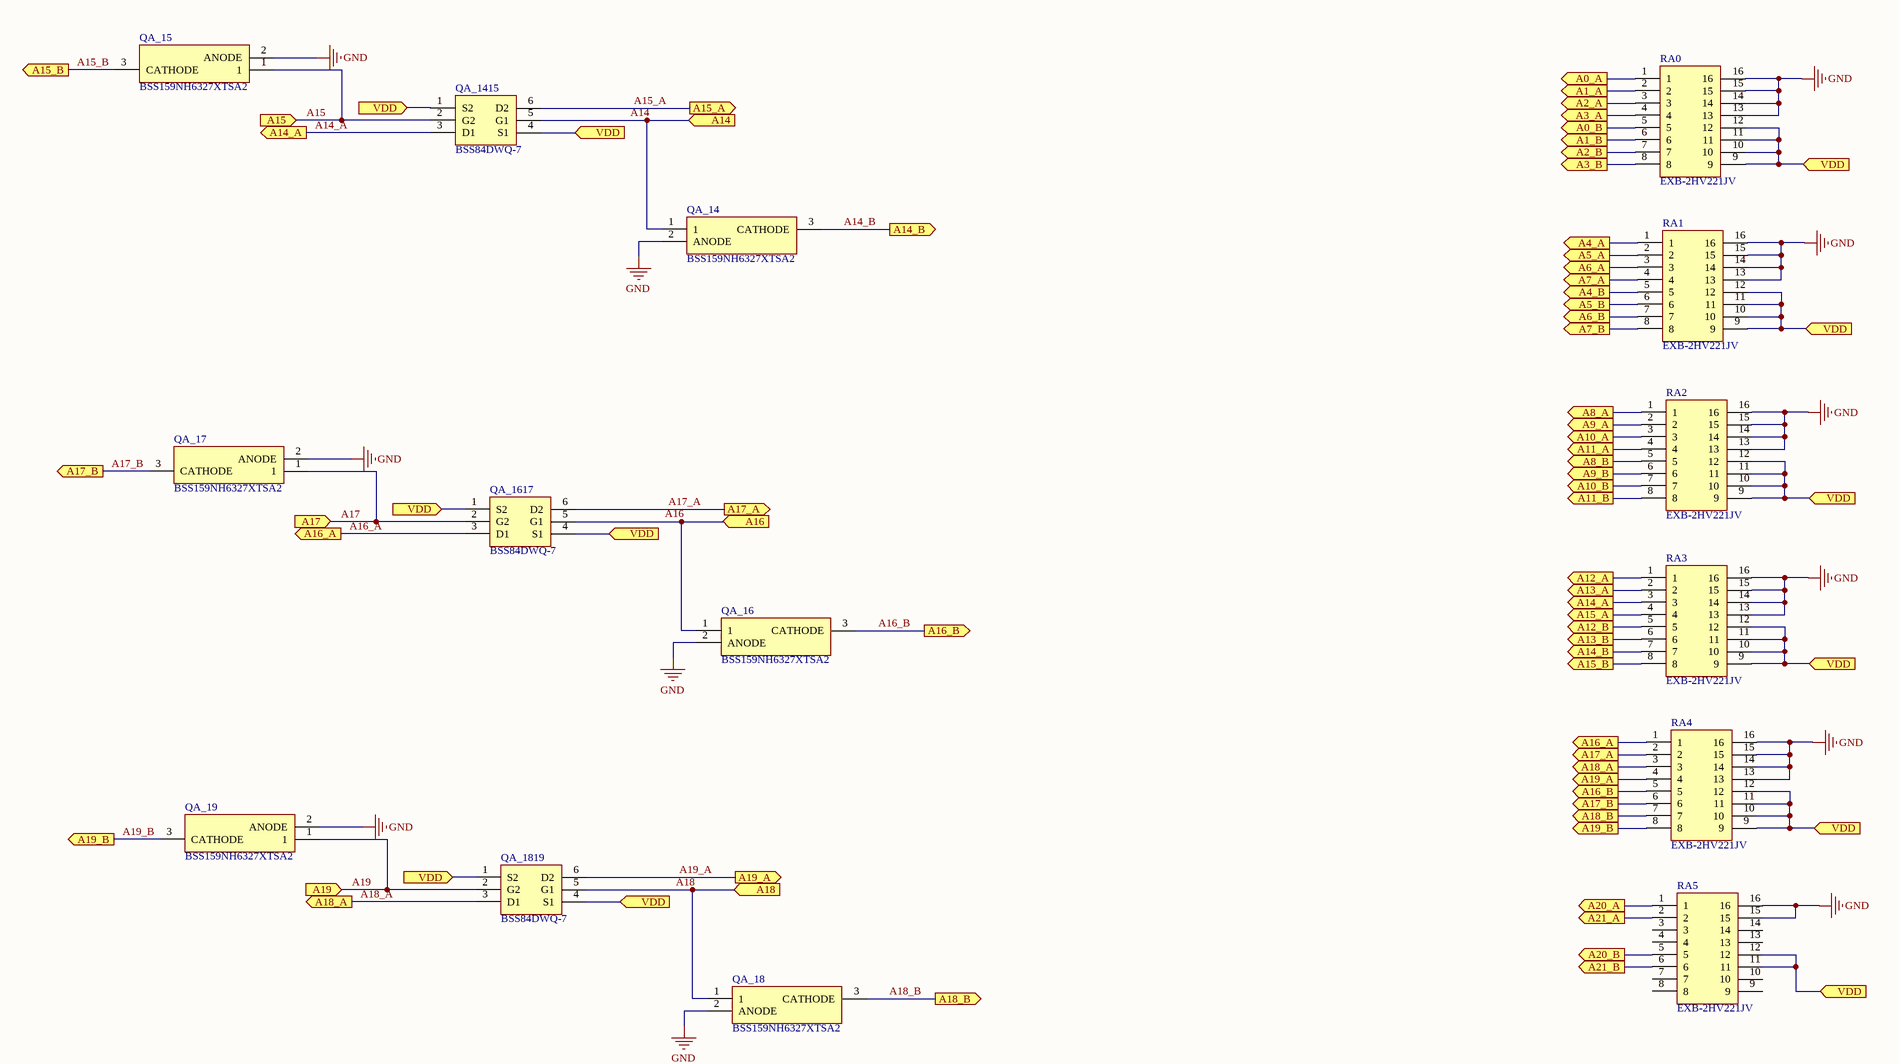
[diagram p15: AddressBUS.SchDoc, top right]
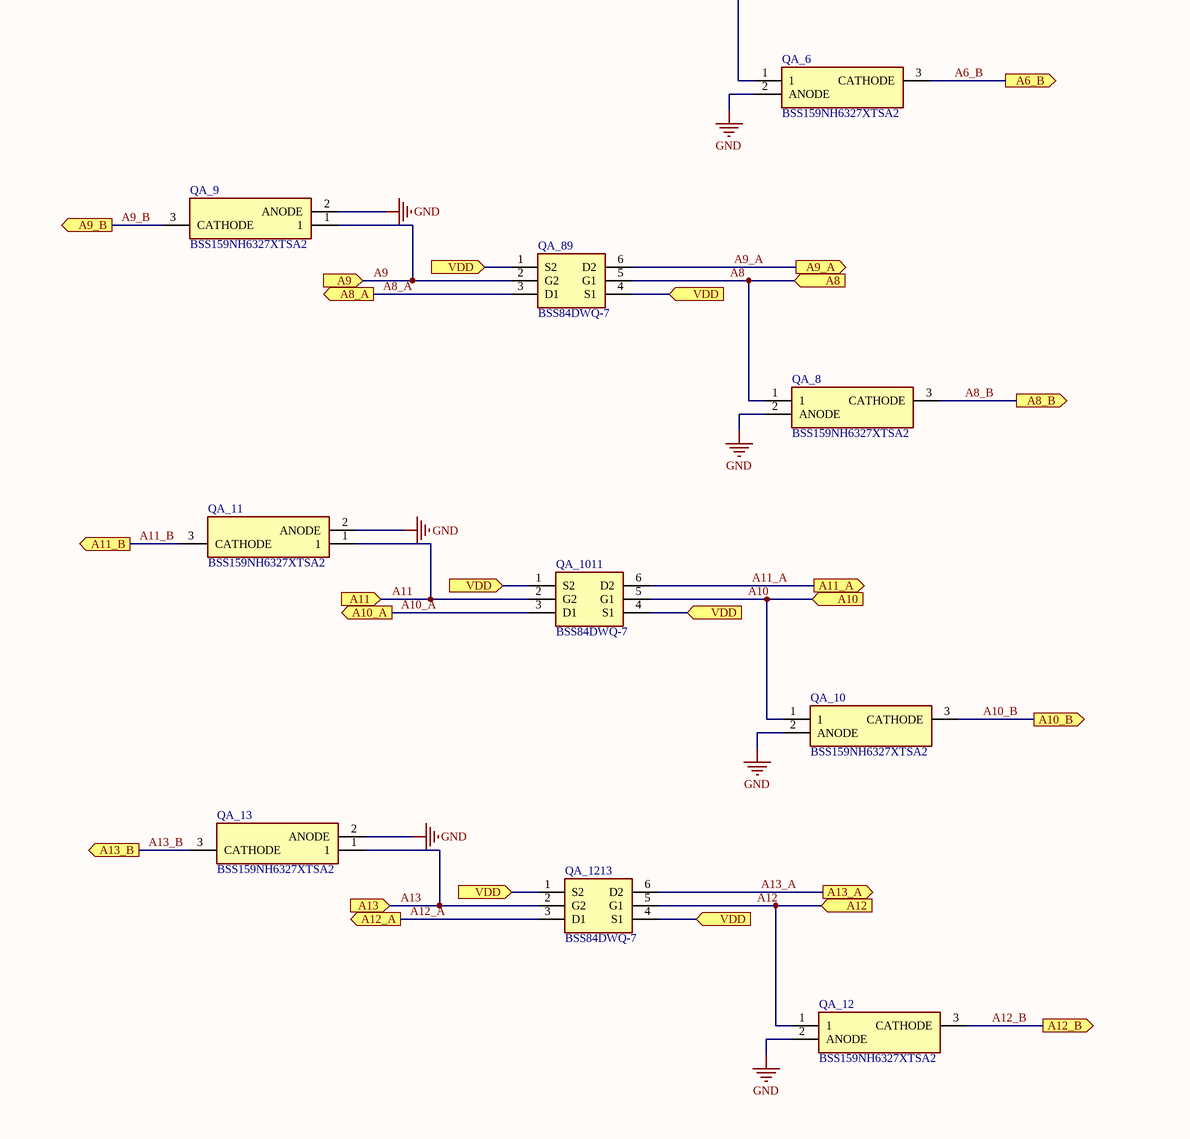
[diagram p16: AddressBUS.SchDoc, bottom left]
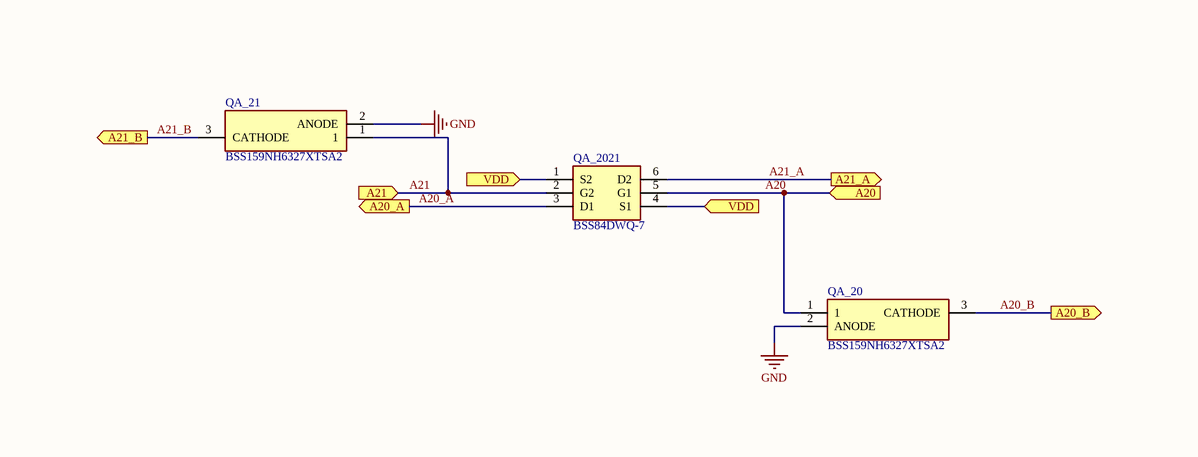
[diagram p17: AddressBUS.SchDoc, bottom right]

### Parts
QA_0  BSS159NH6327XTSA2  [SOT95P260X110-3N]
QA_01  BSS84DWQ-7  [SOT65P210X110-6N]
QA_1  BSS159NH6327XTSA2  [SOT95P260X110-3N]
QA_2  BSS159NH6327XTSA2  [SOT95P260X110-3N]
QA_3  BSS159NH6327XTSA2  [SOT95P260X110-3N]
QA_4  BSS159NH6327XTSA2  [SOT95P260X110-3N]
QA_5  BSS159NH6327XTSA2  [SOT95P260X110-3N]
QA_6  BSS159NH6327XTSA2  [SOT95P260X110-3N]
QA_7  BSS159NH6327XTSA2  [SOT95P260X110-3N]
QA_8  BSS159NH6327XTSA2  [SOT95P260X110-3N]
QA_9  BSS159NH6327XTSA2  [SOT95P260X110-3N]
QA_10  BSS159NH6327XTSA2  [SOT95P260X110-3N]
QA_11  BSS159NH6327XTSA2  [SOT95P260X110-3N]
QA_12  BSS159NH6327XTSA2  [SOT95P260X110-3N]
QA_13  BSS159NH6327XTSA2  [SOT95P260X110-3N]
QA_14  BSS159NH6327XTSA2  [SOT95P260X110-3N]
QA_15  BSS159NH6327XTSA2  [SOT95P260X110-3N]
QA_16  BSS159NH6327XTSA2  [SOT95P260X110-3N]
QA_17  BSS159NH6327XTSA2  [SOT95P260X110-3N]
QA_18  BSS159NH6327XTSA2  [SOT95P260X110-3N]
QA_19  BSS159NH6327XTSA2  [SOT95P260X110-3N]
QA_20  BSS159NH6327XTSA2  [SOT95P260X110-3N]
QA_21  BSS159NH6327XTSA2  [SOT95P260X110-3N]
QA_23  BSS84DWQ-7  [SOT65P210X110-6N]
QA_45  BSS84DWQ-7  [SOT65P210X110-6N]
QA_67  BSS84DWQ-7  [SOT65P210X110-6N]
QA_89  BSS84DWQ-7  [SOT65P210X110-6N]
QA_1011  BSS84DWQ-7  [SOT65P210X110-6N]
QA_1213  BSS84DWQ-7  [SOT65P210X110-6N]
QA_1415  BSS84DWQ-7  [SOT65P210X110-6N]
QA_1617  BSS84DWQ-7  [SOT65P210X110-6N]
QA_1819  BSS84DWQ-7  [SOT65P210X110-6N]
QA_2021  BSS84DWQ-7  [SOT65P210X110-6N]
RA0  EXB-2HV221JV  [EXB2HV221JV]
RA1  EXB-2HV221JV  [EXB2HV221JV]
RA2  EXB-2HV221JV  [EXB2HV221JV]
RA3  EXB-2HV221JV  [EXB2HV221JV]
RA4  EXB-2HV221JV  [EXB2HV221JV]
RA5  EXB-2HV221JV  [EXB2HV221JV]

### Ports
A0 (in), A0_A (out), A0_B (out), A1 (in), A1_A (out), A1_B (out), A2 (in), A2_A (out), A2_B (out), A3 (in), A3_A (out), A3_B (out), A4 (in), A4_A (out), A4_B (out), A5 (in), A5_A (out), A5_B (out), A6 (in), A6_A (out), A6_B (out), A7 (in), A7_A (out), A7_B (out), A8 (in), A8_A (out), A8_B (out), A9 (in), A9_A (out), A9_B (out), A10 (in), A10_A (out), A10_B (out), A11 (in), A11_A (out), A11_B (out), A12 (in), A12_A (out), A12_B (out), A13 (in), A13_A (out), A13_B (out), A14 (in), A14_A (out), A14_B (out), A15 (in), A15_A (out), A15_B (out), A16 (in), A16_A (out), A16_B (out), A17 (in), A17_A (out), A17_B (out), A18 (in), A18_A (out), A18_B (out), A19 (in), A19_A (out), A19_B (out), A20 (in), A20_A (out), A20_B (out), A21 (in), A21_A (out), A21_B (out), VDD (in)

### Nets
GND: QA_0.2(ANODE) QA_1.2(ANODE) QA_2.2(ANODE) QA_3.2(ANODE) QA_4.2(ANODE) QA_5.2(ANODE) QA_6.2(ANODE) QA_7.2(ANODE) QA_8.2(ANODE) QA_9.2(ANODE) QA_10.2(ANODE) QA_11.2(ANODE) QA_12.2(ANODE) QA_13.2(ANODE) QA_14.2(ANODE) QA_15.2(ANODE) QA_16.2(ANODE) QA_17.2(ANODE) QA_18.2(ANODE) QA_19.2(ANODE) QA_20.2(ANODE) QA_21.2(ANODE) RA0.13 RA0.14 RA0.15 RA0.16 RA1.13 RA1.14 RA1.15 RA1.16 RA2.13 RA2.14 RA2.15 RA2.16 RA3.13 RA3.14 RA3.15 RA3.16 RA4.13 RA4.14 RA4.15 RA4.16 RA5.15 RA5.16
A0: QA_0.1 QA_01.5(G1) ; port A0
A0_A: QA_01.3(D1) RA0.1 ; port A0_A
A0_B: QA_0.3(CATHODE) RA0.5 ; port A0_B
A1: QA_1.1 QA_01.2(G2) ; port A1
A1_A: QA_01.6(D2) RA0.2 ; port A1_A
A1_B: QA_1.3(CATHODE) RA0.6 ; port A1_B
A2: QA_2.1 QA_23.5(G1) ; port A2
A2_A: QA_23.3(D1) RA0.3 ; port A2_A
A2_B: QA_2.3(CATHODE) RA0.7 ; port A2_B
A3: QA_3.1 QA_23.2(G2) ; port A3
A3_A: QA_23.6(D2) RA0.4 ; port A3_A
A3_B: QA_3.3(CATHODE) RA0.8 ; port A3_B
A4: QA_4.1 QA_45.5(G1) ; port A4
A4_A: QA_45.3(D1) RA1.1 ; port A4_A
A4_B: QA_4.3(CATHODE) RA1.5 ; port A4_B
A5: QA_5.1 QA_45.2(G2) ; port A5
A5_A: QA_45.6(D2) RA1.2 ; port A5_A
A5_B: QA_5.3(CATHODE) RA1.6 ; port A5_B
A6: QA_6.1 QA_67.5(G1) ; port A6
A6_A: QA_67.3(D1) RA1.3 ; port A6_A
A6_B: QA_6.3(CATHODE) RA1.7 ; port A6_B
A7: QA_7.1 QA_67.2(G2) ; port A7
A7_A: QA_67.6(D2) RA1.4 ; port A7_A
A7_B: QA_7.3(CATHODE) RA1.8 ; port A7_B
A8: QA_8.1 QA_89.5(G1) ; port A8
A8_A: QA_89.3(D1) RA2.1 ; port A8_A
A8_B: QA_8.3(CATHODE) RA2.5 ; port A8_B
A9: QA_9.1 QA_89.2(G2) ; port A9
A9_A: QA_89.6(D2) RA2.2 ; port A9_A
A9_B: QA_9.3(CATHODE) RA2.6 ; port A9_B
A10: QA_10.1 QA_1011.5(G1) ; port A10
A10_A: QA_1011.3(D1) RA2.3 ; port A10_A
A10_B: QA_10.3(CATHODE) RA2.7 ; port A10_B
A11: QA_11.1 QA_1011.2(G2) ; port A11
A11_A: QA_1011.6(D2) RA2.4 ; port A11_A
A11_B: QA_11.3(CATHODE) RA2.8 ; port A11_B
A12: QA_12.1 QA_1213.5(G1) ; port A12
A12_A: QA_1213.3(D1) RA3.1 ; port A12_A
A12_B: QA_12.3(CATHODE) RA3.5 ; port A12_B
A13: QA_13.1 QA_1213.2(G2) ; port A13
A13_A: QA_1213.6(D2) RA3.2 ; port A13_A
A13_B: QA_13.3(CATHODE) RA3.6 ; port A13_B
A14: QA_14.1 QA_1415.5(G1) ; port A14
A14_A: QA_1415.3(D1) RA3.3 ; port A14_A
A14_B: QA_14.3(CATHODE) RA3.7 ; port A14_B
A15: QA_15.1 QA_1415.2(G2) ; port A15
A15_A: QA_1415.6(D2) RA3.4 ; port A15_A
A15_B: QA_15.3(CATHODE) RA3.8 ; port A15_B
A16: QA_16.1 QA_1617.5(G1) ; port A16
A16_A: QA_1617.3(D1) RA4.1 ; port A16_A
A16_B: QA_16.3(CATHODE) RA4.5 ; port A16_B
A17: QA_17.1 QA_1617.2(G2) ; port A17
A17_A: QA_1617.6(D2) RA4.2 ; port A17_A
A17_B: QA_17.3(CATHODE) RA4.6 ; port A17_B
A18: QA_18.1 QA_1819.5(G1) ; port A18
A18_A: QA_1819.3(D1) RA4.3 ; port A18_A
A18_B: QA_18.3(CATHODE) RA4.7 ; port A18_B
A19: QA_19.1 QA_1819.2(G2) ; port A19
A19_A: QA_1819.6(D2) RA4.4 ; port A19_A
A19_B: QA_19.3(CATHODE) RA4.8 ; port A19_B
A20: QA_20.1 QA_2021.5(G1) ; port A20
A20_A: QA_2021.3(D1) RA5.1 ; port A20_A
A20_B: QA_20.3(CATHODE) RA5.5 ; port A20_B
A21: QA_21.1 QA_2021.2(G2) ; port A21
A21_A: QA_2021.6(D2) RA5.2 ; port A21_A
A21_B: QA_21.3(CATHODE) RA5.6 ; port A21_B
VDD: QA_01.1(S2) QA_01.4(S1) QA_23.1(S2) QA_23.4(S1) QA_45.1(S2) QA_45.4(S1) QA_67.1(S2) QA_67.4(S1) QA_89.1(S2) QA_89.4(S1) QA_1011.1(S2) QA_1011.4(S1) QA_1213.1(S2) QA_1213.4(S1) QA_1415.1(S2) QA_1415.4(S1) QA_1617.1(S2) QA_1617.4(S1) QA_1819.1(S2) QA_1819.4(S1) QA_2021.1(S2) QA_2021.4(S1) RA0.9 RA0.10 RA0.11 RA0.12 RA1.9 RA1.10 RA1.11 RA1.12 RA2.9 RA2.10 RA2.11 RA2.12 RA3.9 RA3.10 RA3.11 RA3.12 RA4.9 RA4.10 RA4.11 RA4.12 RA5.11 RA5.12 ; port VDD

Not connected (* = marked no-connect by the designer): RA5 3 4 7 8 9 10 13 14

### Library data of the parts
QA_0-QA_21 = BSS159NH6327XTSA2: Transistor; Manufacturer_Name: Infineon; Datasheet Link: http://www.infineon.com/dgdl/Infineon-BSS159N-DS-v02_02-en.pdf?fileId=db3a304330f68606013108d8b2230036; Height: 1.1mm; Manufacturer_Part_Number: BSS159NH6327XTSA2; Mouser Part Number: 726-BSS159NH6327XTSA; Mouser Price/Stock: https://www.mouser.co.uk/ProductDetail/Infineon-Technologies/BSS159NH6327XTSA2?qs=K00xGehIljvJjqRECkxDcQ%3D%3D; Arrow Part Number: BSS159NH6327XTSA2; Arrow Price/Stock: https://www.arrow.com/en/products/bss159nh6327xtsa2/infineon-technologies-ag?region=nac
QA_01 QA_23 QA_45 QA_67 QA_89 QA_1011 QA_1213 QA_1415 QA_1617 QA_1819 QA_2021 = BSS84DWQ-7: Transistor; Manufacturer_Name: Diodes Inc.; Datasheet Link: https://www.diodes.com/assets/Datasheets/BSS84DWQ.pdf; Height: 1.1mm; Manufacturer_Part_Number: BSS84DWQ-7; Mouser Part Number: 621-BSS84DWQ-7; Mouser Price/Stock: https://www.mouser.co.uk/ProductDetail/Diodes-Incorporated/BSS84DWQ-7?qs=W%2FMpXkg%252BdQ4tYNQw8VopWw%3D%3D; Arrow Part Number: BSS84DWQ-7; Arrow Price/Stock: https://www.arrow.com/en/products/bss84dwq-7/diodes-incorporated
RA0-RA5 = EXB-2HV221JV: Resistor Network; Manufacturer_Name: Panasonic; Datasheet Link: https://industrial.panasonic.com/cdbs/www-data/pdf/AOC0000/AOC0000C14.pdf; Height: 0.55mm; Manufacturer_Part_Number: EXB-2HV221JV; Mouser Part Number: 667-EXB-2HV221JV; Mouser Price/Stock: https://www.mouser.co.uk/ProductDetail/Panasonic/EXB-2HV221JV?qs=LZJzOuaToaVYOp9V2U%2F1Gw%3D%3D; Arrow Part Number: EXB-2HV221JV; Arrow Price/Stock: https://www.arrow.com/en/products/exb-2hv221jv/panasonic?region=europe